# EAGLE design P1R4 (EAGLE 7.2.0)

## Sheet 1 of 3
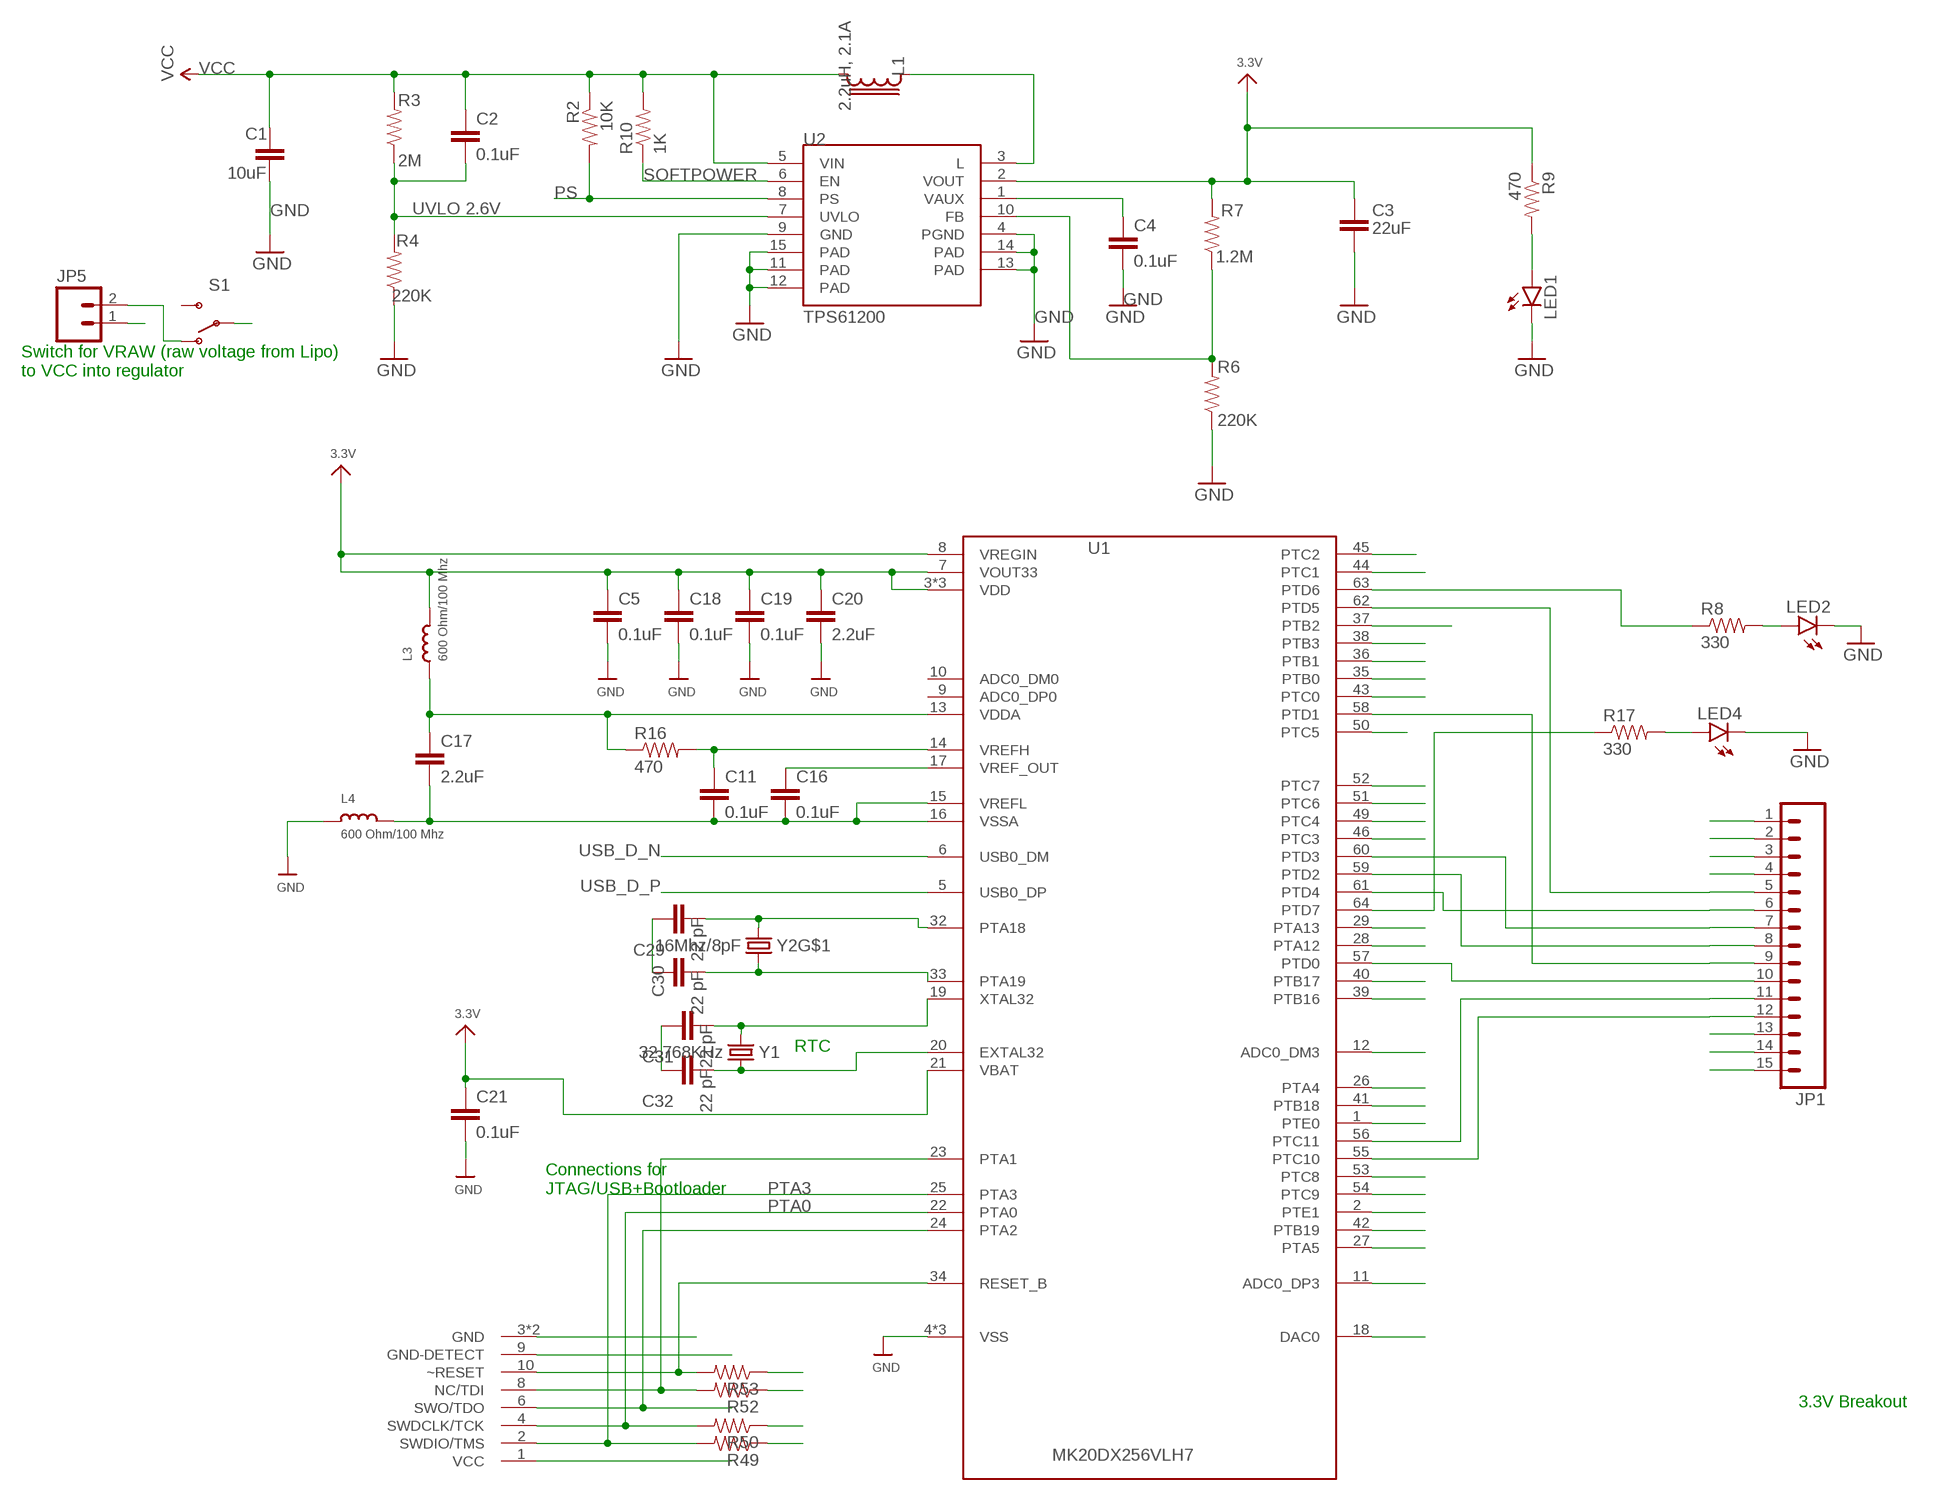
[diagram p0: schematic, sheet 1]

### Parts
C1  10uF  CAPACITOR-10UF  [0603-CAP]
C2  0.1uF  CAPACITOR-0.1UF  [0603-CAP]
C3  22uF  CAPACITOR-22UF  [0603-CAP]
C4  0.1uF  CAPACITOR-0.1UF  [0603-CAP]
C5  0.1uF  CAPACITOR-0.1UF  [0603-CAP]
C11  0.1uF  CAPACITOR-0.1UF  [0603-CAP]
C16  0.1uF  CAPACITOR-0.1UF  [0603-CAP]
C17  2.2uF  CAPACITOR-2.2UF  [0603-CAP]
C18  0.1uF  CAPACITOR-0.1UF  [0603-CAP]
C19  0.1uF  CAPACITOR-0.1UF  [0603-CAP]
C20  2.2uF  CAPACITOR-2.2UF  [0603-CAP]
C21  0.1uF  CAPACITOR-0.1UF  [0603-CAP]
C29  22 pF  CAPACITOR-10UF  [0603-CAP]
C30  22 pF  CAPACITOR-10UF  [0603-CAP]
C31  22 pF  CAPACITOR-10UF  [0603-CAP]
C32  22 pF  CAPACITOR-10UF  [0603-CAP]
JP1  M15  [1X15]
JP5  M02PTH  [1X02]
L1  2.2uH, 2.1A  LPS30152.2UH  [LPS3015]
L3  600 Ohm/100 Mhz  INDUCTOR-BK2125HM601-T  [0805]
L4  600 Ohm/100 Mhz  INDUCTOR-BK2125HM601-T  [0805]
LED1  LED-GREEN  [LED-0603]
LED2  LED-GREEN  [LED-0603]
LED4  LED-GREEN  [LED-0603]
R2  10K  RESISTOR-10K  [0603-RES]
R3  2M  RESISTOR-2M  [0603-RES]
R4  220K  RESISTOR-220K  [0603-RES]
R6  220K  RESISTOR-220K  [0603-RES]
R7  1.2M  RESISTOR-1.2M  [0603-RES]
R8  330  RESISTOR-470  [0603-RES]
R9  470  RESISTOR-470  [0603-RES]
R10  1K  RESISTOR-1K  [0603-RES]
R16  470  RESISTOR-470  [0603-RES]
R17  330  RESISTOR-470  [0603-RES]
R49  RESISTOR0402-RES  [0402-RES]
R50  RESISTOR0402-RES  [0402-RES]
R52  RESISTOR0402-RES  [0402-RES]
R53  RESISTOR0402-RES  [0402-RES]
S1  SWITCH-SPDT-SMD-A  [SWITCH-SPST-SMD-A]
U1  MK20DX256VLH7  [MK20DX256VLH7]
U2  TPS61200  [QFN-10_PAD]
U$7  2X5_0.05"_CORTEX_DEBUGTH_NOKEY_UNSHROUDED  [2X5_0.05"_TH_NS]
Y1  32.768KHz  CRYSTAL/32.768KHZ/SMD-TXC_7A  [CRYSTAL-TXC-7A]
Y2  16Mhz/8pF  CRYSTAL/SMD-5X3-GND16MHZ/8PF  [CRYSTAL-SMD-5X3]

### Nets
3.3V: C3.1 C5.1 C18.1 C19.1 C20.1 C21.1 JP1.13 JP1.14 JP1.15 L3.2 R7.2 R9.1 R49.1 R52.1 R53.1 U1.3(VDD) U1.7(VOUT33) U1.8(VREGIN) U1.21(VBAT) U1.30(VDD) U1.48(VDD) U2.2(VOUT) U$7.1(VCC) ; also sheet 2,3
A12: U1.11(ADC0_DP3)
A13: U1.12(ADC0_DM3)
AD0: U1.45(PTC2) ; also sheet 2
DAC/A14: U1.18(DAC0)
FB: R6.2 R7.1 U2.10(FB)
GND [Top GND Pour]: C1.2 C3.2 C4.2 C5.2 C18.2 C19.2 C20.2 C21.2 C29.1 C30.1 C31.1 C32.1 JP1.1 JP1.2 JP1.3 JP1.4 JP5.1 L4.1 LED1.C LED2.C LED4.C R4.1 R6.1 R50.1 U1.4(VSS) U1.31(VSS) U1.47(VSS) U2.4(PGND) U2.9(GND) U2.11(PAD) U2.12(PAD) U2.13(PAD) U2.14(PAD) U2.15(PAD) U$7.3(GND) U$7.5(GND) U$7.9(GND-DETECT) ; also sheet 2,3
N$1: LED1.A R9.2
N$2: L1.1 U2.3(L)
N$7: LED2.A R8.2
N$10: C31.2 U1.19(XTAL32) Y1.P$2
N$11: C32.2 U1.20(EXTAL32) Y1.P$1
N$27: C29.2 U1.32(PTA18) Y2.3
N$28: C30.2 U1.33(PTA19) Y2.1
N$29: LED4.A R17.2
PS: R2.2 U2.8(PS)
PTA0: R50.2 U1.22(PTA0) U$7.4(SWDCLK/TCK)
PTA1: R52.2 U1.23(PTA1) U$7.8(NC/TDI)
PTA2: U1.24(PTA2) U$7.6(SWO/TDO)
PTA3: R49.2 U1.25(PTA3) U$7.2(SWDIO/TMS)
PTA4: U1.26(PTA4)
PTA5: U1.27(PTA5)
PTA12: U1.28(PTA12)
PTA13: U1.29(PTA13)
PTB0: U1.35(PTB0) ; also sheet 2
PTB1: U1.36(PTB1) ; also sheet 2
PTB16: U1.39(PTB16) ; also sheet 2
PTB17: U1.40(PTB17) ; also sheet 2
PTB18: U1.41(PTB18) ; also sheet 2
PTB19: U1.42(PTB19) ; also sheet 2
PTC0: U1.43(PTC0) ; also sheet 2
PTC1: U1.44(PTC1) ; also sheet 2
PTC3: U1.46(PTC3) ; also sheet 2
PTC4: U1.49(PTC4) ; also sheet 2
PTC5: U1.50(PTC5) ; also sheet 2
PTC6: U1.51(PTC6) ; also sheet 2
PTC7: U1.52(PTC7) ; also sheet 2
PTC8: U1.53(PTC8) ; also sheet 2
PTC9: U1.54(PTC9) ; also sheet 2
PTC10: JP1.12 U1.55(PTC10)
PTC11: JP1.11 U1.56(PTC11)
PTD0: JP1.10 U1.57(PTD0)
PTD1: JP1.9 U1.58(PTD1)
PTD2: JP1.8 U1.59(PTD2)
PTD3: JP1.7 U1.60(PTD3)
PTD4: JP1.6 U1.61(PTD4)
PTD5: JP1.5 U1.62(PTD5)
PTD6: R8.1 U1.63(PTD6)
PTD7: R17.1 U1.64(PTD7)
PTE0: U1.1(PTE0)
PTE1: U1.2(PTE1)
RESET_B: R53.2 U1.34(RESET_B) U$7.10(~RESET)
SCL: U1.37(PTB2) ; also sheet 2,3
SDA: U1.38(PTB3) ; also sheet 2,3
SOFTPOWER: R10.1 U2.6(EN)
USB_D_N [USB]: U1.6(USB0_DM)
USB_D_P [USB]: U1.5(USB0_DP)
UVLO: C2.2 R3.1 R4.2 U2.7(UVLO)
VAUX: C4.1 U2.1(VAUX)
VCC: C1.1 C2.1 L1.2 R2.1 R3.2 R10.2 S1.2(P) U2.5(VIN)
VDDA: C17.1 L3.1 R16.1 U1.13(VDDA)
VRAW: JP5.2 S1.1(O)
VREF_OUT: C16.1 U1.17(VREF_OUT)
VREFH: C11.1 R16.2 U1.14(VREFH)
VREFL: C11.2 C16.2 C17.2 L4.2 U1.15(VREFL) U1.16(VSSA)
Unconnected: S1.3(S) U1.9(ADC0_DP0) U1.10(ADC0_DM0) Y2.2(GND:GND) Y2.4(GND:GND)

### Notes on the sheet
- UVLO 2.6V
- Switch for VRAW (raw voltage from Lipo) 
  to VCC into regulator
- RTC
- Connections for 
  JTAG/USB+Bootloader
- 3.3V Breakout

## Sheet 2 of 3
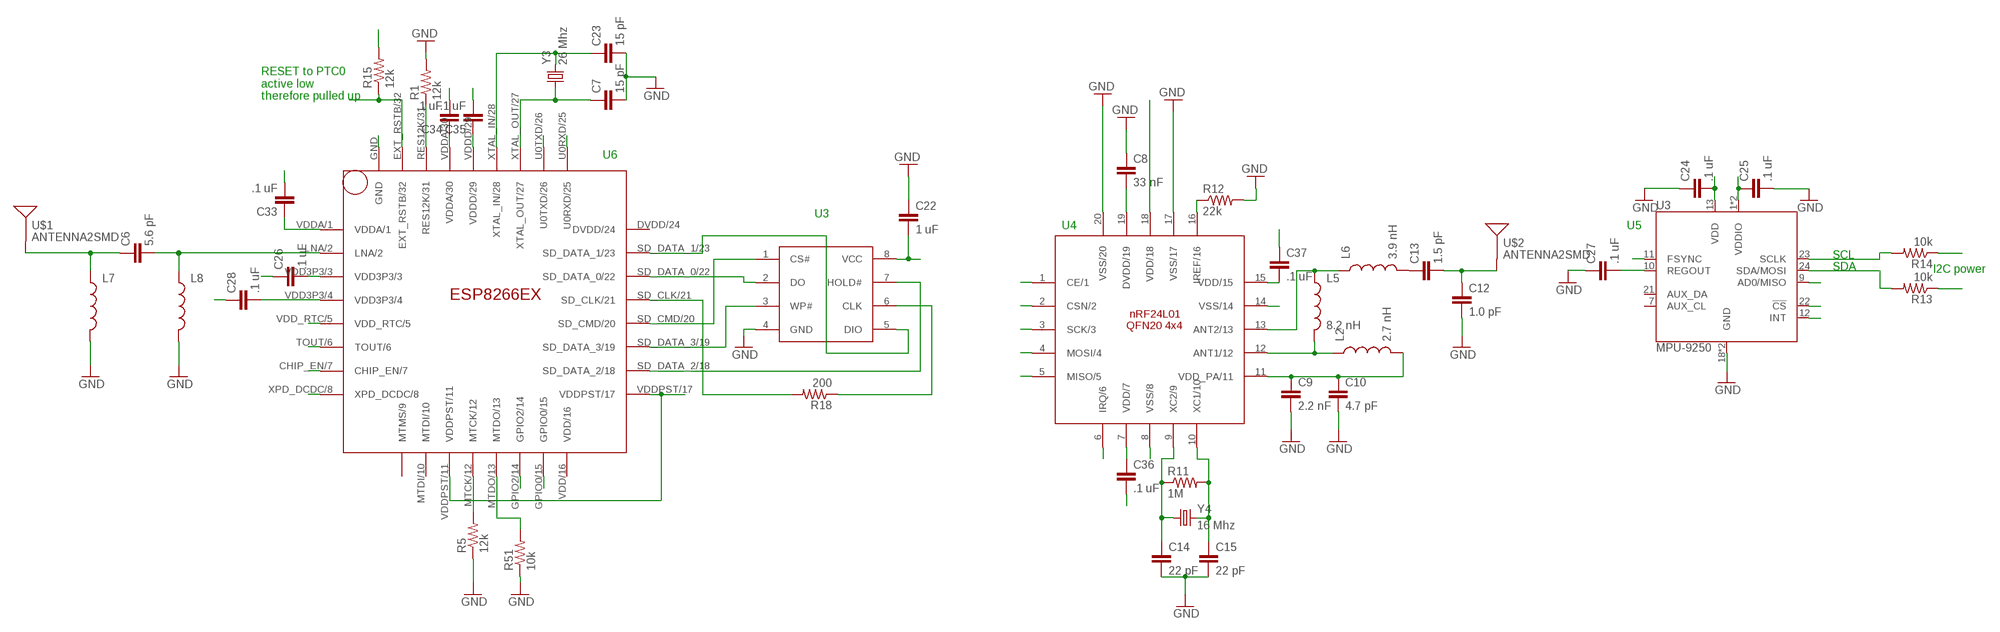
[diagram p1: schematic, sheet 2]

### Parts
C6  5.6 pF  CAP0603-CAP  [0603-CAP]
C7  15 pF  CAP0603-CAP  [0603-CAP]
C8  33 nF  CAP0603-CAP  [0603-CAP]
C9  2.2 nF  CAP0603-CAP  [0603-CAP]
C10  4.7 pF  CAP0603-CAP  [0603-CAP]
C12  1.0 pF  CAP0603-CAP  [0603-CAP]
C13  1.5 pF  CAP0603-CAP  [0603-CAP]
C14  22 pF  CAP0603-CAP  [0603-CAP]
C15  22 pF  CAP0603-CAP  [0603-CAP]
C22  1 uF  CAP0603-CAP  [0603-CAP]
C23  15 pF  CAP0603-CAP  [0603-CAP]
C24  .1 uF  CAP0603-CAP  [0603-CAP]
C25  .1 uF  CAP0603-CAP  [0603-CAP]
C26  .1 uF  CAP0603-CAP  [0603-CAP]
C27  .1 uF  CAP0603-CAP  [0603-CAP]
C28  .1 uF  CAP0603-CAP  [0603-CAP]
C33  .1 uF  CAP0603-CAP  [0603-CAP]
C34  .1 uF  CAP0603-CAP  [0603-CAP]
C35  .1 uF  CAP0603-CAP  [0603-CAP]
C36  .1 uF  CAP0603-CAP  [0603-CAP]
C37  .1 uF  CAP0603-CAP  [0603-CAP]
L2  2.7 nH  INDUCTOR0402  [C0402]
L5  8.2 nH  INDUCTOR0402  [C0402]
L6  3.9 nH  INDUCTOR0402  [C0402]
L7  INDUCTOR30OHM,1.8A  [0603]
L8  INDUCTOR30OHM,1.8A  [0603]
R1  12k  RESISTOR0603-RES  [0603-RES]
R5  12k  RESISTOR0603-RES  [0603-RES]
R11  1M  RESISTOR0603-RES  [0603-RES]
R12  22k  RESISTOR0603-RES  [0603-RES]
R13  10k  RESISTOR0603-RES  [0603-RES]
R14  10k  RESISTOR0603-RES  [0603-RES]
R15  12k  RESISTOR0603-RES  [0603-RES]
R18  200  RESISTOR0603-RES  [0603-RES]
R51  10k  RESISTOR0603-RES  [0603-RES]
U3  MPU-9250  [QFN-24/3MM]
U$1  ANTENNA2SMD  [ANTENNA-CHIP2]
U$2  ANTENNA2SMD  [ANTENNA-CHIP2]
U$3  25Q40  [SOP8]
U$4  NRF24L01  [QFN20(4X4)]
U$6  ESP8266EX  [QFN32]
Y3  26 Mhz  CRYSTAL5X3  [CRYSTAL-SMD-5X3]
Y4  16 Mhz  CRYSTAL5X3  [CRYSTAL-SMD-5X3]

### Nets
3.3V: C22.2 C24.2 C25.1 C26.2 C28.2 C33.1 C34.1 C35.1 C36.1 C37.2 R13.1 R14.1 R15.2 U3.1(VDDIO) U3.8(VDDIO) U3.13(VDD) U3.22(!CS) U$3.8(VCC) U$4.7(VDD/7) U$4.15(VDD/15) U$4.18(VDD/18) U$6.VDD3P3/3 U$6.VDD3P3/4 U$6.VDDA/1 U$6.VDDA/30 U$6.VDDD/29 U$6.VDDPST/11 U$6.VDDPST/17 ; also sheet 1,3
AD0: U3.9(AD0/MISO) ; also sheet 1
GND [Top GND Pour]: C7.2 C8.1 C9.2 C10.2 C12.2 C14.2 C15.2 C22.1 C23.2 C24.1 C25.2 C26.1 C27.1 C28.1 C33.2 C34.2 C35.2 C36.2 C37.1 L7.2 L8.2 R1.2 R5.1 R12.2 R51.1 U3.18(GND) U3.20(GND) U$3.4(GND) U$4.8(VSS/8) U$4.14(VSS/14) U$4.17(VSS/17) U$4.20(VSS/20) U$6.GND ; also sheet 1,3
MTDO: R51.2 U$6.MTDO/13
N$13: C6.2 L8.1 U$6.LNA/2
N$16: C6.1 L7.1 U$1.FEED(SIGNAL)
N$17: C14.1 R11.1 U$4.9(XC2/9) Y4.1
N$18: C15.1 R11.2 U$4.10(XC1/10) Y4.3
N$19: C9.1 C10.1 L2.2 U$4.11(VDD_PA/11)
N$20: L5.1 L6.1 U$4.13(ANT2/13)
N$21: C8.2 U$4.19(DVDD/19)
N$23: L2.1 L5.2 U$4.12(ANT1/12)
N$24: R12.1 U$4.16(IREF/16)
N$25: C13.1 L6.2
N$26: C12.1 C13.2 U$2.FEED(SIGNAL)
N$32: R5.2 U$6.MTCK/12
N$34: C27.2 U3.10(REGOUT)
N$35: R18.1 U$3.6(CLK)
N$38: R1.1 U$6.RES12K/31
PTB0: U3.12(INT) ; also sheet 1
PTB1: U3.11(FSYNC) ; also sheet 1
PTB16: U$6.U0TXD/26 ; also sheet 1
PTB17: U$6.U0RXD/25 ; also sheet 1
PTB18: U$6.GPIO0/15 ; also sheet 1
PTB19: U$6.GPIO2/14 ; also sheet 1
PTC0: R15.1 U$6.EXT_RSTB/32 ; also sheet 1
PTC1: U$6.CHIP_EN/7 ; also sheet 1
PTC3: U$6.XPD_DCDC/8 ; also sheet 1
PTC4: U$4.2(CSN/2) ; also sheet 1
PTC5: U$4.3(SCK/3) ; also sheet 1
PTC6: U$4.4(MOSI/4) ; also sheet 1
PTC7: U$4.5(MISO/5) ; also sheet 1
PTC8: U$4.6(IRQ/6) ; also sheet 1
PTC9: U$4.1(CE/1) ; also sheet 1
RTC: U$6.VDD_RTC/5
SCL: R14.2 U3.23(SCLK) ; also sheet 1,3
SD-CLK: R18.2 U$6.SD_CLK/21
SD-CMD: U$3.1(CS#) U$6.SD_CMD/20
SD-D0: U$3.2(DO) U$6.SD_DATA_0/22
SD-D1: U$3.5(DIO) U$6.SD_DATA_1/23
SD-D2: U$3.7(HOLD#) U$6.SD_DATA_2/18
SD-D3: U$3.3(WP#) U$6.SD_DATA_3/19
SDA: R13.2 U3.24(SDA/MOSI) ; also sheet 1,3
TOUT: U$6.TOUT/6
XTAL_IN: C23.1 U$6.XTAL_IN/28 Y3.3
XTAL_OUT: C7.1 U$6.XTAL_OUT/27 Y3.1
Unconnected: U3.7(AUX_CL) U3.21(AUX_DA) U$6.DVDD/24 U$6.MTDI/10 U$6.MTMS/9 U$6.VDD/16

### Notes on the sheet
- RESET to PTC0
  active low
  therefore pulled up
- U6
- U3
- U4 | U5
- SCL
- I2C power
- SDA

## Sheet 3 of 3
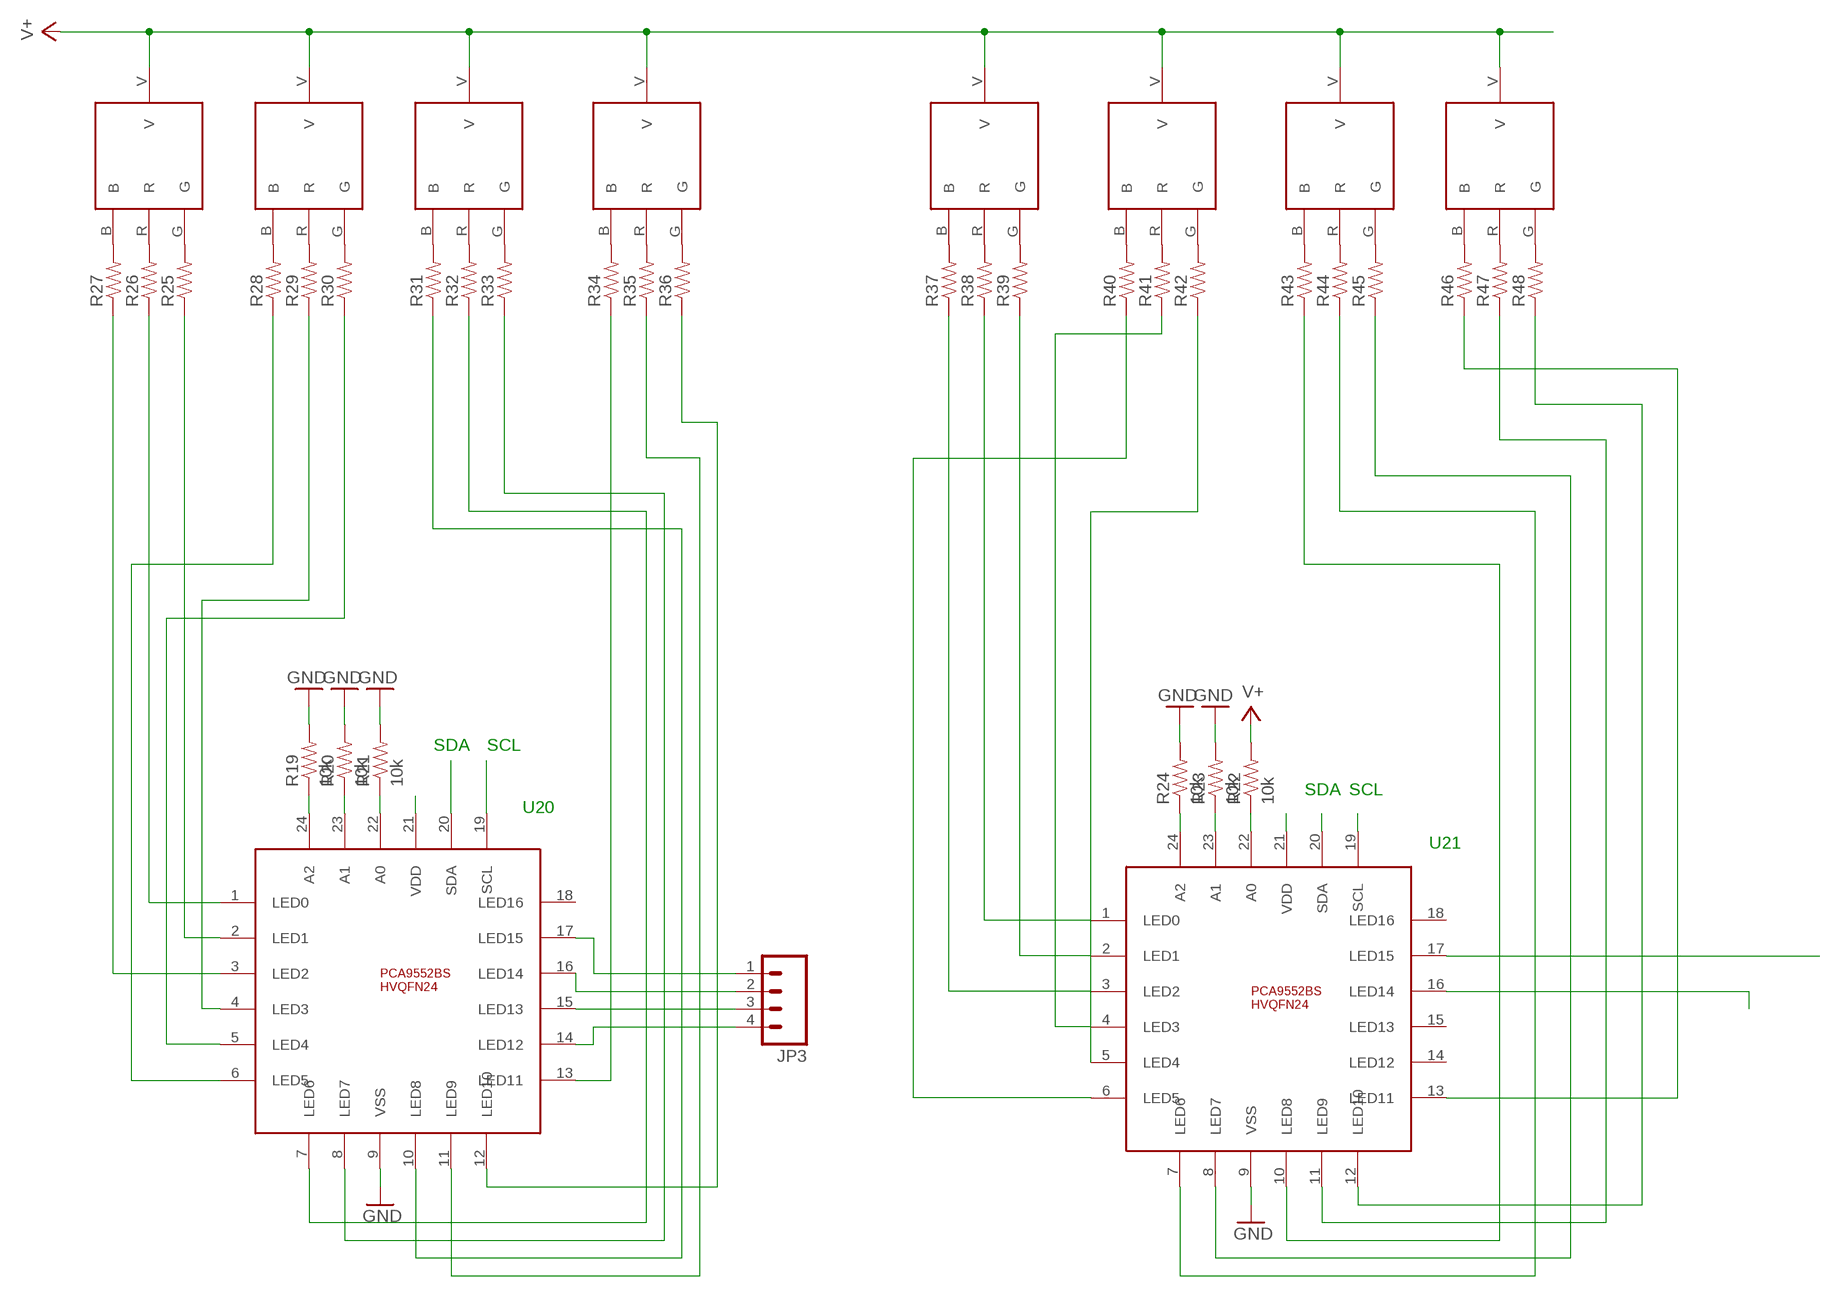
[diagram p2: schematic, sheet 3]

### Parts
JP3  M04PTH  [1X04]
R19  10k  RESISTOR0603-RES  [0603-RES]
R20  10k  RESISTOR0603-RES  [0603-RES]
R21  10k  RESISTOR0603-RES  [0603-RES]
R22  10k  RESISTOR0603-RES  [0603-RES]
R23  10k  RESISTOR0603-RES  [0603-RES]
R24  10k  RESISTOR0603-RES  [0603-RES]
R25  RESISTOR0402-RES  [0402-RES]
R26  RESISTOR0402-RES  [0402-RES]
R27  RESISTOR0402-RES  [0402-RES]
R28  RESISTOR0402-RES  [0402-RES]
R29  RESISTOR0402-RES  [0402-RES]
R30  RESISTOR0402-RES  [0402-RES]
R31  RESISTOR0402-RES  [0402-RES]
R32  RESISTOR0402-RES  [0402-RES]
R33  RESISTOR0402-RES  [0402-RES]
R34  RESISTOR0402-RES  [0402-RES]
R35  RESISTOR0402-RES  [0402-RES]
R36  RESISTOR0402-RES  [0402-RES]
R37  RESISTOR0402-RES  [0402-RES]
R38  RESISTOR0402-RES  [0402-RES]
R39  RESISTOR0402-RES  [0402-RES]
R40  RESISTOR0402-RES  [0402-RES]
R41  RESISTOR0402-RES  [0402-RES]
R42  RESISTOR0402-RES  [0402-RES]
R43  RESISTOR0402-RES  [0402-RES]
R44  RESISTOR0402-RES  [0402-RES]
R45  RESISTOR0402-RES  [0402-RES]
R46  RESISTOR0402-RES  [0402-RES]
R47  RESISTOR0402-RES  [0402-RES]
R48  RESISTOR0402-RES  [0402-RES]
U$8  LTST-C19FD1WT  [LTST-C19FD1WT]
U$11  LTST-C19FD1WT  [LTST-C19FD1WT]
U$13  LTST-C19FD1WT  [LTST-C19FD1WT]
U$14  LTST-C19FD1WT  [LTST-C19FD1WT]
U$15  LTST-C19FD1WT  [LTST-C19FD1WT]
U$16  LTST-C19FD1WT  [LTST-C19FD1WT]
U$17  LTST-C19FD1WT  [LTST-C19FD1WT]
U$18  LTST-C19FD1WT  [LTST-C19FD1WT]
U$20  PCA9552BS  [HVQFN24]
U$21  PCA9552BS  [HVQFN24]

### Nets
3.3V: R22.2 U$8.V U$11.V U$13.V U$14.V U$15.V U$16.V U$17.V U$18.V U$20.21(VDD) U$21.21(VDD) ; supply symbol labelled V+ ; also sheet 1,2
GND [Top GND Pour]: R19.2 R20.2 R21.2 R23.2 R24.2 U$20.9(VSS) U$21.9(VSS) ; also sheet 1,2
N$8: JP3.3 U$20.15(LED13)
N$9: U$21.16(LED14)
N$39: R26.2 U$8.R
N$40: R19.1 U$20.24(A2)
N$41: R27.2 U$8.B
N$42: R25.2 U$8.G
N$45: R28.2 U$11.B
N$46: R29.2 U$11.R
N$47: R30.2 U$11.G
N$48: R27.1 U$20.3(LED2)
N$49: R26.1 U$20.1(LED0)
N$50: R31.2 U$13.B
N$51: R28.1 U$20.6(LED5)
N$60: R32.2 U$13.R
N$61: R33.2 U$13.G
N$62: R34.2 U$14.B
N$63: R35.2 U$14.R
N$73: R25.1 U$20.2(LED1)
N$75: R29.1 U$20.4(LED3)
N$76: R30.1 U$20.5(LED4)
N$78: R32.1 U$20.7(LED6)
N$79: R33.1 U$20.8(LED7)
N$80: R31.1 U$20.10(LED8)
N$81: R36.2 U$14.G
N$82: R35.1 U$20.11(LED9)
N$83: R36.1 U$20.12(LED10)
N$84: R34.1 U$20.13(LED11)
N$85: JP3.4 U$20.14(LED12)
N$86: R37.2 U$15.B
N$87: R20.1 U$20.23(A1)
N$88: R21.1 U$20.22(A0)
N$89: R38.2 U$15.R
N$90: U$21.17(LED15)
N$91: JP3.2 U$20.16(LED14)
N$92: R38.1 U$21.1(LED0)
N$93: R39.1 U$21.2(LED1)
N$94: R37.1 U$21.3(LED2)
N$95: R41.1 U$21.4(LED3)
N$96: R42.1 U$21.5(LED4)
N$97: R40.1 U$21.6(LED5)
N$98: R44.1 U$21.7(LED6)
N$99: R45.1 U$21.8(LED7)
N$100: R39.2 U$15.G
N$101: R43.1 U$21.10(LED8)
N$102: R47.1 U$21.11(LED9)
N$103: R48.1 U$21.12(LED10)
N$104: R46.1 U$21.13(LED11)
N$105: JP3.1 U$20.17(LED15)
N$106: R24.1 U$21.24(A2)
N$107: R23.1 U$21.23(A1)
N$108: R22.1 U$21.22(A0)
N$109: R40.2 U$16.B
N$112: R41.2 U$16.R
N$113: R42.2 U$16.G
N$114: R43.2 U$17.B
N$115: R44.2 U$17.R
N$116: R45.2 U$17.G
N$117: R46.2 U$18.B
N$118: R47.2 U$18.R
N$119: R48.2 U$18.G
SCL: U$20.19(SCL) U$21.19(SCL) ; also sheet 1,2
SDA: U$20.20(SDA) U$21.20(SDA) ; also sheet 1,2
Unconnected: U$20.18(LED16) U$21.14(LED12) U$21.15(LED13) U$21.18(LED16)

### Notes on the sheet
- SDA | SCL
- SDA | SCL
- U20
- U21

## Library data of the parts
C1 = appfruits:CAPACITOR; MF: Murata; MPN: GRM188R60J106ME47D
C2 C4 C5 C11 C16 C18 C19 C21 = appfruits:CAPACITOR; MF: Kemet; MPN: C0603C104J3RACTU
C3 = appfruits:CAPACITOR; MF: Murata; MPN: GRM188R60J226MEA0D
C6-C10 C12-C15 C22-C28 C33-C37 = SparkFun-Capacitors:CAP: Capacitor Standard 0603 ceramic capacitor, and 0.1" leaded capacitor.
C17 C20 = appfruits:CAPACITOR; MF: Kemet; MPN: C0603C225K4PACTU
C29-C32 = appfruits:CAPACITOR; MF: Murata; MPN: GRM188R60J106ME47D; VALUE: 10uF
JP1 = SparkFun-Connectors:M15: Header 15 Standard 15-pin 0.1" header. Use with straight break away headers (SKU : PRT-00116), right angle break away headers (PRT-00553), swiss pins (PRT-00743), machine pins (PRT-00117), and female headers (PRT-00115).
JP3 = SparkFun:M04: Header 4 Standard 4-pin 0.1" header. Use with straight break away headers (SKU : PRT-00116), right angle break away headers (PRT-00553), swiss pins (PRT-00743), machine pins (PRT-00117), and female headers (PRT-00115). Molex polarized connector foot print use with SKU : PRT-08231 with associated crimp pins and housings.
JP5 = SparkFun-Connectors:M02: Standard 2-pin 0.1" header. Use with - straight break away headers ( PRT-00116) - right angle break away headers (PRT-00553) - swiss pins (PRT-00743) - machine pins (PRT-00117) - female headers (PRT-00115) Molex polarized connector foot print use with: PRT-08233 with associated crimp pins and housings. 2.54_SCREWTERM for use with PRT-10571. 3.5mm Screw Terminal footprints for PRT-08084 5mm Screw Terminal footprints for use with PRT-08432
L1 = appfruits:LPS3015: Shielded Power Inductor; MF: Coilcraft; MPN: LPS3015-222MRB
L2 L5 L6 = SparkFun-Passives:INDUCTOR: Inductors
L3 L4 = appfruits:INDUCTOR: Inductors; MF: Taiyo Yuden; MPN: BK2125HM601-T
L7 L8 = SparkFun-Passives:INDUCTOR: Inductors; PROD_ID: RES-07859
LED1 LED2 LED4 = appfruits:LED: LEDs Standard schematic elements and footprints for 5mm, 3mm, 1206, and 0603 sized LEDs. 5mm - Spark Fun Electronics SKU : COM-00529 (and others); MF: Avago; MPN: HSMG-C190
R1 R5 R11-R15 R18 R51 = SparkFun-Resistors:RESISTOR: Resistor
R2 = appfruits:RESISTOR: Resistor; MF: Panasonic; MPN: ERJ-3GEYJ103V
R3 = appfruits:RESISTOR: Resistor; MF: Panasonic; MPN: ERJ-3GEYJ205V
R4 R6 = appfruits:RESISTOR: Resistor; MF: Panasonic; MPN: ERJ-3GEYJ224V
R7 = appfruits:RESISTOR: Resistor; MF: Panasonic; MPN: ERJ-3GEYJ125V
R8 R17 = appfruits:RESISTOR: Resistor; MF: Panasonic; MPN: ERJ-3GEYJ471V; VALUE: 470
R9 R16 = appfruits:RESISTOR: Resistor; MF: Panasonic; MPN: ERJ-3GEYJ471V
R10 = appfruits:RESISTOR: Resistor; MF: Panasonic; MPN: ERJ-3GEYJ102V
R19-R50 R52 R53 = SparkFun:RESISTOR: Resistor
S1 = SparkFun-Electromechanical:SWITCH-SPDT: SPDT Switch Simple slide switch, Spark Fun Electronics SKU : COM-00102 DPDT SMT slide switch, AYZ0202, SWCH-08179
U1 = appfruits:MK20DX256VLH7; MF: Freescale; MPN: MK20DX256VLH7
U2 = appfruits:TPS61200: DC to DC Booster IC-10035; MF: Texas Instruments; MPN: TPS61200DRCR; PROD_ID: IC-10035
U3 = chips:MPU-9250: GYRO/ACCEL/COMPASS/9-AXIS; DIGIKEY: 1428-1019-1-ND
U$1 U$2 = SparkFun-RF:ANTENNA2: Chip antenna Single endded antenna. Common with smaller chip antennas. CHIP4 package is the GPS Chip Antenna SKU: GPS-08418. CHIP5 package is 2.4GHz chip antenna SKU: WRL-00144.
U$3 = wifi:25Q40
U$4 = RF:NRF24L01
U$6 = wifi:ESP8266EX
U$7 = con-cortex:2X5_0.05"_CORTEX_DEBUG
U$8 U$11 U$13-U$18 = led:LTST-C19FD1WT
U$20 U$21 = NXP_By_element14_Batch_1:PCA9552BS
Y1 = appfruits:CRYSTAL/32.768KHZ/SMD-TXC_7A; MF: Epson Timing; MPN: FC-255 32.7680K-A3
Y2 = appfruits:CRYSTAL/SMD-5X3-GND; MF: ECS; MPN: ECS-160-8-30B-CKM
Y3 Y4 = SparkFun-FreqCtrl:CRYSTAL: Various standard crystals. Proven footprints.; PROD_ID: XTAL-08218

## Net classes
1 USB: width 0.254 mm, drill 0.33 mm, clearance 0.159 mm

## Board
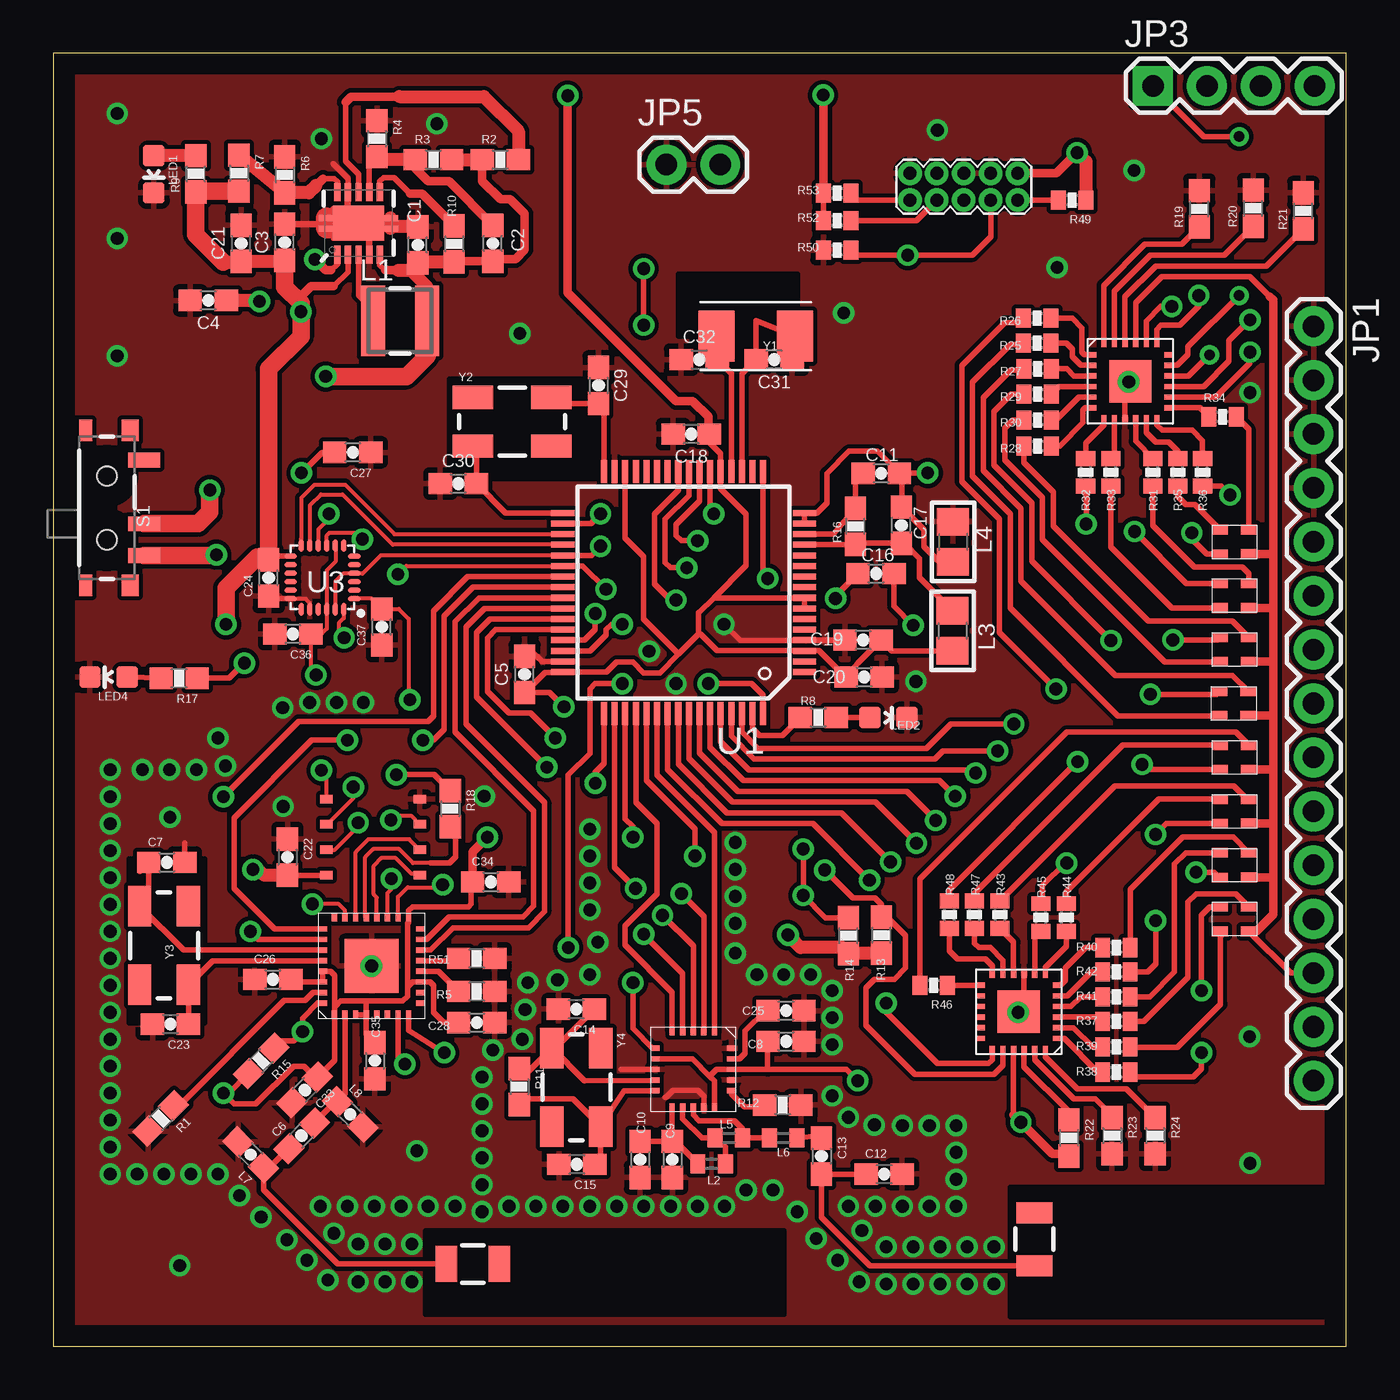
[diagram p3: board, top side]
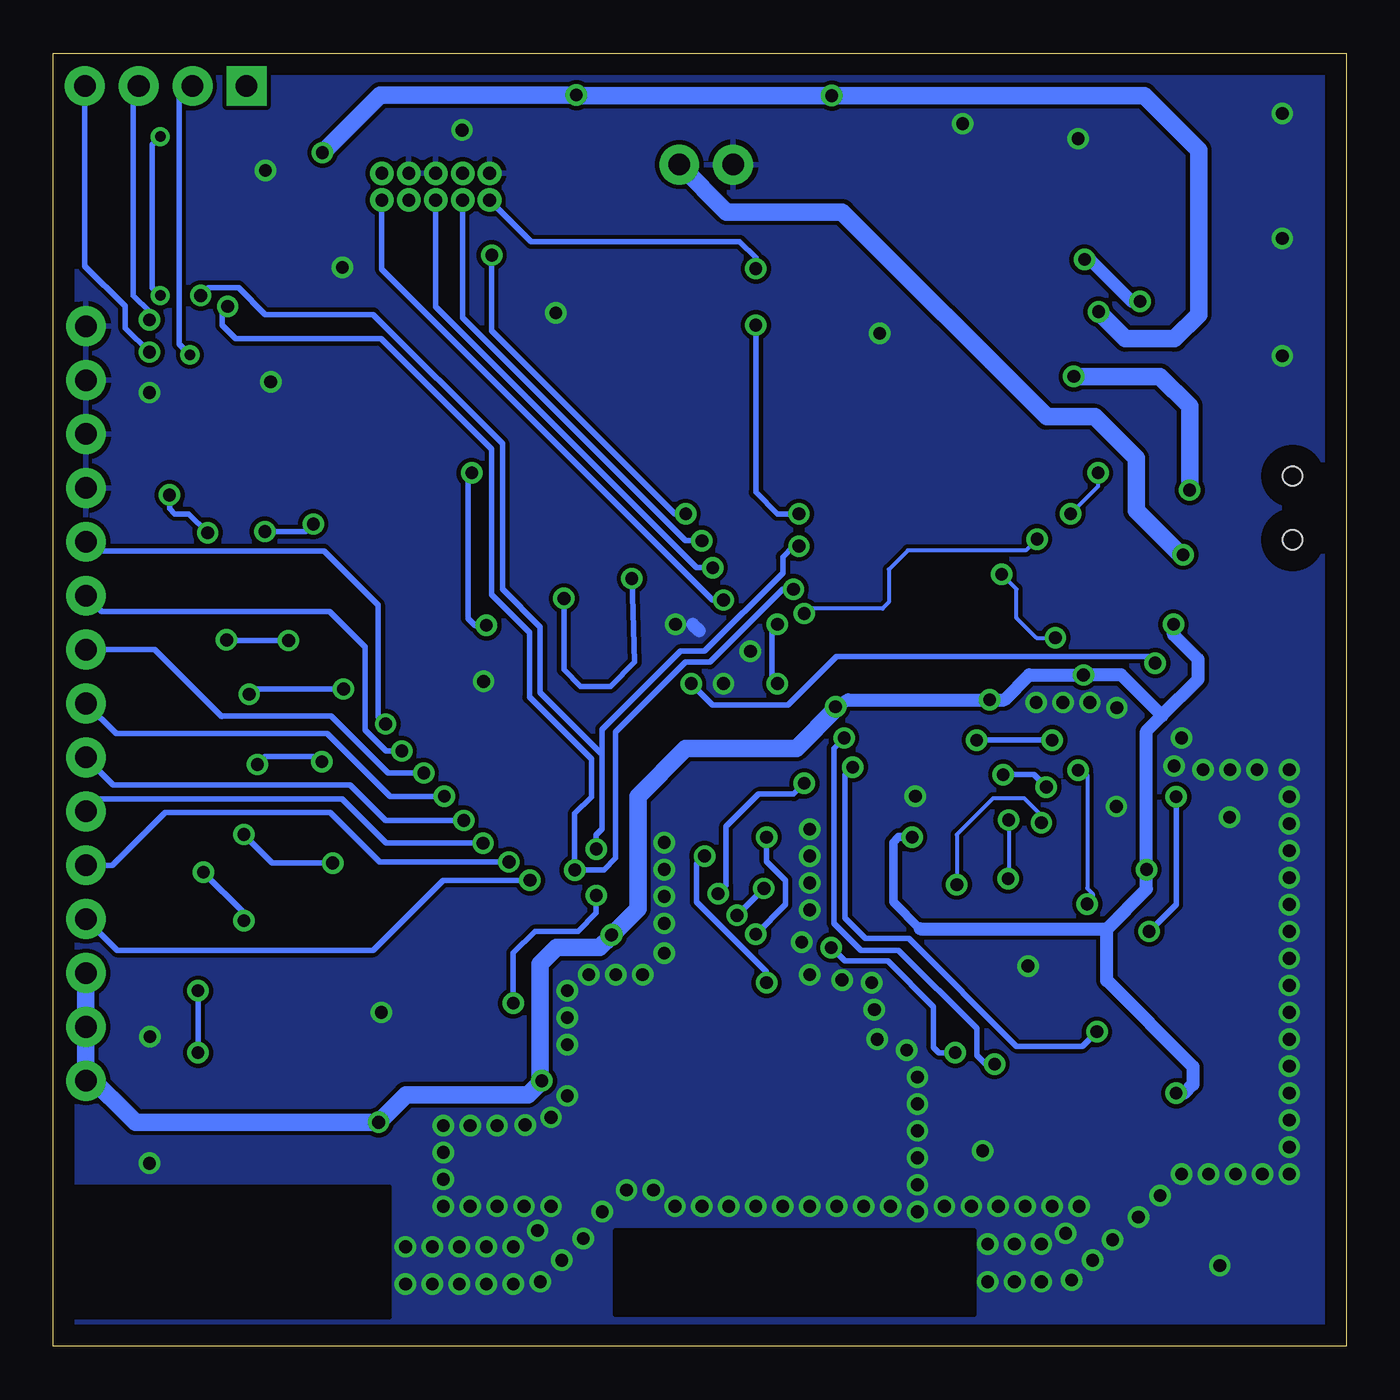
[diagram p4: board, bottom side, seen from below]

Size 60.96 x 60.96 mm. Coordinates in mm from the lower left corner, seen from the top.
Outline: 0,0 60.96,0 60.96,60.96 0,60.96 0,0
Copper layers (1*16): Top 0.035mm / dielectric 1.5mm / Bottom 0.035mm
Design rules "default": minimum track width 10mil, minimum drill 24mil, track to track 8mil, track to pad 8mil, pad to pad 8mil, via to via 8mil, smd to smd 8mil, copper to edge 40mil, drill to drill 8mil, minimum pad ring 10mil, minimum via ring 8mil, stop-mask expansion 4mil, vias tented up to drill 0mil, thermal gap 10mil
tRestrict: area 3.6,15.2 to 7.1,23; area 18.7,40.9 to 25.7,45.6; area 29.5,46.1 to 35.1,50.5; area 45.1,1.4 to 60.9,7.5; area 17.6,1.5 to 34.4,5.5; area 12.2,51.4 to 16.7,54.5
bRestrict: area 45.1,1.4 to 60.9,7.5; area 17.6,1.5 to 34.4,5.5

### Footprints (pad centres in the part's own frame; a part is rotated, then mirrored left to right if it is on the bottom)
0603-CAP = smd 1.1 x 1: 1 -0.85,0; 2 0.85,0
1X15 = drill 1.016 pad 1.88: 1 0,0; 2 2.54,0; 3 5.08,0; 4 7.62,0; 5 10.16,0; 6 12.7,0; 7 15.24,0; 8 17.78,0; 9 20.32,0; 10 22.86,0; 11 25.4,0; 12 27.94,0; 13 30.48,0; 14 33.02,0; 15 35.56,0
1X04 = drill 1.016 pad 1.88 square: 1 0,0 | drill 1.016 pad 1.88: 2 2.54,0; 3 5.08,0; 4 7.62,0
1X02 = drill 1.016 pad 1.88: 1 0,0; 2 2.54,0
LPS3015 = smd 1.14 x 3.3: 1 -1.27,0; 2 1.27,0
C0402 = smd 0.7 x 0.9: 1 -0.65,0; 2 0.65,0
0805 = smd 1.3 x 1.5: 1 -0.95,0; 2 0.95,0
0603 = smd 1.1 x 1: 1 -0.85,0; 2 0.85,0
LED-0603 = smd 1 x 1: A 0,-0.877; C 0,0.877
0603-RES = smd 1.1 x 1: 1 -0.85,0; 2 0.85,0
0402-RES = smd 0.7 x 0.9: 1 -0.65,0; 2 0.65,0
SWITCH-SPST-SMD-A = smd 0.7 x 1.5: 1 -2.25,-1.75; 2 -0.75,-1.75; 3 2.25,-1.75 | smd 1 x 0.6: GND1 -3.65,1; GND3 3.65,1 | smd 1 x 0.8: GND2 -3.65,-1.1; GND4 3.65,-1.1 | hole 0.9: -1.5,0; 1.5,0
MK20DX256VLH7 = smd 1.1 x 0.285: 1 -5.7,3.75; 2 -5.7,3.25; 3 -5.7,2.75; 4 -5.7,2.25; 5 -5.7,1.75; 6 -5.7,1.25; 7 -5.7,0.75; 8 -5.7,0.25; 9 -5.7,-0.25; 10 -5.7,-0.75; 11 -5.7,-1.25; 12 -5.7,-1.75; 13 -5.7,-2.25; 14 -5.7,-2.75; 15 -5.7,-3.25; 16 -5.7,-3.75; 33 5.7,-3.75; 34 5.7,-3.25; 35 5.7,-2.75; 36 5.7,-2.25; 37 5.7,-1.75; 38 5.7,-1.25; 39 5.7,-0.75; 40 5.7,-0.25; 41 5.7,0.25; 42 5.7,0.75; 43 5.7,1.25; 44 5.7,1.75; 45 5.7,2.25; 46 5.7,2.75; 47 5.7,3.25; 48 5.7,3.75 | smd 0.285 x 1.1: 17 -3.75,-5.7; 18 -3.25,-5.7; 19 -2.75,-5.7; 20 -2.25,-5.7; 21 -1.75,-5.7; 22 -1.25,-5.7; 23 -0.75,-5.7; 24 -0.25,-5.7; 25 0.25,-5.7; 26 0.75,-5.7; 27 1.25,-5.7; 28 1.75,-5.7; 29 2.25,-5.7; 30 2.75,-5.7; 31 3.25,-5.7; 32 3.75,-5.7; 49 3.75,5.7; 50 3.25,5.7; 51 2.75,5.7; 52 2.25,5.7; 53 1.75,5.7; 54 1.25,5.7; 55 0.75,5.7; 56 0.25,5.7; 57 -0.25,5.7; 58 -0.75,5.7; 59 -1.25,5.7; 60 -1.75,5.7; 61 -2.25,5.7; 62 -2.75,5.7; 63 -3.25,5.7; 64 -3.75,5.7
QFN-10_PAD = smd 0.297 x 0.85: 1 -1,-1.475; 2 -0.5,-1.475; 3 0,-1.475; 4 0.5,-1.475; 5 1,-1.475; 6 1,1.475; 7 0.5,1.475; 8 0,1.475; 9 -0.5,1.475; 10 -1,1.475 | smd 0.7 x 0.28: 11 -1.5,0.25; 12 -1.5,-0.25; 13 1.5,0.25; 14 1.5,-0.25 | smd 2.4 x 1.65: 15 0,0
QFN-24/3MM = smd 0.6 x 0.23: 1 -1.5,1; 2 -1.5,0.6; 3 -1.5,0.2; 4 -1.5,-0.2; 5 -1.5,-0.6; 6 -1.5,-1; 13 1.5,-1; 14 1.5,-0.6; 15 1.5,-0.2; 16 1.5,0.2; 17 1.5,0.6; 18 1.5,1 | smd 0.23 x 0.6: 7 -1,-1.5; 8 -0.6,-1.5; 9 -0.2,-1.5; 10 0.2,-1.5; 11 0.6,-1.5; 12 1,-1.5; 19 1,1.5; 20 0.6,1.5; 21 0.2,1.5; 22 -0.2,1.5; 23 -0.6,1.5; 24 -1,1.5
ANTENNA-CHIP2 = smd 1.7 x 1: FEED 0,1.25; P$2 0,-1.25
SOP8 = smd 0.6 x 0.4: 1 -2.2,1.8; 2 -2.2,0.6; 3 -2.2,-0.6; 4 -2.2,-1.8; 5 2.2,-1.8; 6 2.2,-0.6; 7 2.2,0.6; 8 2.2,1.8
QFN20(4X4) = smd 0.4 x 0.25: 1 -1.8,1; 2 -1.8,0.5; 3 -1.8,0; 4 -1.8,-0.5; 5 -1.8,-1; 11 1.8,-1; 12 1.8,-0.5; 13 1.8,0; 14 1.8,0.5; 15 1.8,1 | smd 0.25 x 0.4: 6 -1,-1.8; 7 -0.5,-1.8; 8 0,-1.8; 9 0.5,-1.8; 10 1,-1.8; 16 1,1.8; 17 0.5,1.8; 18 0,1.8; 19 -0.5,1.8; 20 -1,1.8
QFN32 = smd 0.4 x 0.25: CHIP_EN/7 -2.3,-1.25; DVDD/24 2.3,1.75; LNA/2 -2.3,1.25; SD_CLK/21 2.3,0.25; SD_CMD/20 2.3,-0.25; SD_DATA_0/22 2.3,0.75; SD_DATA_1/23 2.3,1.25; SD_DATA_2/18 2.3,-1.25; SD_DATA_3/19 2.3,-0.75; TOUT/6 -2.3,-0.75; VDD3P3/3 -2.3,0.75; VDD3P3/4 -2.3,0.25; VDD_RTC/5 -2.3,-0.25; VDDA/1 -2.3,1.75; VDDPST/17 2.3,-1.75; XPD_DCDC/8 -2.3,-1.75 | smd 0.25 x 0.4: EXT_RSTB/32 -1.75,2.3; GPIO0/15 1.25,-2.3; GPIO2/14 0.75,-2.3; MTCK/12 -0.25,-2.3; MTDI/10 -1.25,-2.3; MTDO/13 0.25,-2.3; MTMS/9 -1.75,-2.3; RES12K/31 -1.25,2.3; U0RXD/25 1.75,2.3; U0TXD/26 1.25,2.3; VDD/16 1.75,-2.3; VDDA/30 -0.75,2.3; VDDD/29 -0.25,2.3; VDDPST/11 -0.75,-2.3; XTAL_IN/28 0.25,2.3; XTAL_OUT/27 0.75,2.3 | smd 2.54 x 2.54: GND 0,0
2X5_0.05"_TH_NS = drill 0.6 pad 0.95: 1 -2.54,-0.635; 2 -2.54,0.635; 3 -1.27,-0.635; 4 -1.27,0.635; 5 0,-0.635; 6 0,0.635; 7 1.27,-0.635; 8 1.27,0.635; 9 2.54,-0.635; 10 2.54,0.635
LTST-C19FD1WT = smd 0.75 x 0.45: B 0.68,0.58; G -0.68,-0.58; P$5 0.68,-0.58; R -0.68,0.58; V 0.68,-0.57
HVQFN24 = smd 0.4 x 0.25: 1 -1.8,1.25; 2 -1.8,0.75; 3 -1.8,0.25; 4 -1.8,-0.25; 5 -1.8,-0.75; 6 -1.8,-1.25; 13 1.8,-1.25; 14 1.8,-0.75; 15 1.8,-0.25; 16 1.8,0.25; 17 1.8,0.75; 18 1.8,1.25 | smd 0.25 x 0.4: 7 -1.25,-1.8; 8 -0.75,-1.8; 9 -0.25,-1.8; 10 0.25,-1.8; 11 0.75,-1.8; 12 1.25,-1.8; 19 1.25,1.8; 20 0.75,1.8; 21 0.25,1.8; 22 -0.25,1.8; 23 -0.75,1.8; 24 -1.25,1.8 | smd 2 x 2: P$1 0,0
CRYSTAL-TXC-7A = smd 1.7 x 2.4: P$1 1.85,0; P$2 -1.85,0
CRYSTAL-SMD-5X3 = smd 1.9 x 1.1: 1 -1.85,-1.15; 2 1.85,-1.15; 3 1.85,1.15; 4 -1.85,1.15

### Placement (x,y rotation side)
C1  17.2,51.92 90 top
C2  20.73,51.99 90 top
C3  10.92,52.04 90 top
C4  7.32,49.3 180 top
C5  22.23,31.67 90 top
C6  11.71,9.93 45 top
C7  5.36,22.81 0 top
C8  34.54,15.82 180 top
C9  29.18,8.81 270 top
C10  27.66,8.81 270 top
C11  39.04,41.15 0 top
C12  39.17,8.13 0 top
C13  36.22,8.97 270 top
C14  24.66,15.9 180 top
C15  24.69,8.59 180 top
C16  38.79,36.42 0 top
C17  39.98,38.71 90 top
C18  30.07,43 180 top
C19  38.18,33.3 180 top
C20  38.23,31.55 0 top
C21  8.86,51.99 90 top
C22  11.05,23.06 270 top
C23  5.54,15.19 180 top
C24  10.16,36.22 90 top
C25  34.54,14.38 0 top
C26  10.36,17.3 0 top
C27  14.12,42.14 180 top
C28  19.96,15.27 180 top
C29  25.7,45.29 270 top
C30  19.1,40.67 0 top
C31  33.99,46.51 180 top
C32  30.45,46.51 0 top
C33  11.86,12.09 225 top
C34  20.62,21.89 0 top
C35  15.16,13.46 270 top
C36  11.3,33.58 180 top
C37  15.49,33.91 90 top
JP1  59.41,48.08 270 top
JP3  51.84,59.41 0 top
JP5  28.91,55.7 0 top
L1  16.36,48.34 0 top
L2  31.04,8.61 180 top
L3  42.39,33.73 270 top
L4  42.42,37.92 270 top
L5  31.85,9.83 180 top
L6  34.42,9.83 0 top
L7  9.32,9.04 135 top
L8  14,10.95 315 top
LED1  4.75,55.24 180 top
LED2  39.37,29.64 270 top
LED4  2.62,31.55 90 top
R1  5.08,10.74 225 top
R2  21.08,55.93 0 top
R3  17.93,55.93 0 top
R4  15.27,56.92 270 top
R5  19.96,16.74 180 top
R6  10.92,55.22 270 top
R7  8.76,55.3 270 top
R8  36.07,29.64 0 top
R9  6.73,55.27 90 top
R10  18.9,51.97 270 top
R11  21.97,12.24 270 top
R12  34.39,11.38 0 top
R13  39.04,19.38 90 top
R14  37.49,19.35 90 top
R15  9.8,13.46 225 top
R16  37.82,38.66 90 top
R17  5.94,31.5 180 top
R18  18.72,25.35 270 top
R19  54.03,53.62 90 top
R20  56.57,53.64 90 top
R21  58.93,53.52 90 top
R22  47.88,9.83 270 top
R23  49.91,9.93 270 top
R24  51.94,9.93 270 top
R25  46.38,47.29 180 top
R26  46.38,48.46 180 top
R27  46.41,46.08 180 top
R28  46.41,42.44 180 top
R29  46.41,44.88 180 top
R30  46.41,43.66 180 top
R31  51.84,41.2 270 top
R32  48.67,41.2 270 top
R33  49.86,41.2 270 top
R34  55.12,43.81 0 top
R35  53.01,41.2 270 top
R36  54.18,41.2 270 top
R37  50.11,15.32 0 top
R38  50.11,12.93 0 top
R39  50.11,14.12 0 top
R40  50.11,18.8 0 top
R41  50.11,16.48 0 top
R42  50.11,17.65 0 top
R43  44.63,20.35 90 top
R44  47.75,20.22 90 top
R45  46.56,20.22 90 top
R46  41.5,17.02 180 top
R47  43.43,20.35 90 top
R48  42.24,20.35 90 top
R49  48.03,54.03 180 top
R50  36.96,51.66 0 top
R51  19.96,18.29 180 top
R52  36.96,53.06 0 top
R53  36.96,54.36 0 top
S1  2.54,39.52 90 top
U1  29.72,35.53 180 top
U2  14.4,52.93 0 top
U3  12.7,36.25 180 top
U$1  19.79,3.89 90 top
U$2  46.25,5.05 180 top
U$3  15.09,24 180 top
U$4  30.18,13.06 270 top
U$6  15.01,17.93 90 top
U$7  42.93,54.66 180 top
U$8  55.65,30.3 0 top
U$11  55.68,32.84 0 top
U$13  55.68,35.38 0 top
U$14  55.68,37.92 0 top
U$15  55.68,20.14 0 top
U$16  55.68,22.68 0 top
U$17  55.68,25.22 0 top
U$18  55.68,27.76 0 top
U$20  50.77,45.49 0 top
U$21  45.52,15.77 180 top
Y1  33.12,47.62 180 top
Y2  21.64,43.59 0 top
Y3  5.23,18.9 270 top
Y4  24.66,12.22 270 top

### Tracks (layer width: path | path; a pad name or v marks a point on that pad's centre or on a via)
3.3V  (via drill 0.6)  (1 unrouted)
  Top 0.178: U3.8 13.31,37.74 13.31,36.98 12.9,36.57 U3.22 | U3.1 15.03,35.25 15.03,35.22 C37.2 16.3,34.76 16.76,34.29 16.76,30.53 v16.82,30.48 | U3.22 12.9,34.83 | U3.22 12.9,33.83 12.47,33.4 12.29,33.58 C36.1 | 12,33.4 C36.1 | 12.9,35.08 U3.22 | v12.39,31.65 12.15,31.89 C36.1
  Top 0.254: U1.21 31.46,41.25 | U1.3 | U1.3 36.09,32.79 37.45,31.43 C20.1 37.95,32.22 C19.1 39.54,32.78 L3.2 | U1.7 U1.8 31.14,35.28 | U1.3 31.29,32.79 30.5,33.58 30.43,33.58 | 31.14,35.28 30.45,34.59 30.43,34.59 30.43,33.58 | C24.2 10.34,37.25 U3.13 | U2.2 13.9,50.63 13.23,49.96 | U$6.VDDA/1 13.26,17.5 13.08,17.68 U$6.VDDD/29 U$6.VDDA/30 11.33,17.18 C26.2 | U$6.VDDA/1 13.26,15.98 13.56,16.28 14.76,16.28 | U$6.VDD3P3/3 U$6.VDD3P3/4 | 16.71,16.94 16.71,16.51 16.48,16.28 14.76,16.28 | 16.71,16.94 16.95,17.18 U$6.VDDPST/11 17.77,17.18 17.93,17.02 17.93,15.75 18.41,15.27 C28.2 | 16.71,16.94 16.71,19.94 16.76,19.99 U$6.VDDPST/17 16.76,20.55 16.94,20.73 19.58,20.73 19.71,20.85 19.71,22.1 | U$4.15 31.18,12.51 30.95,12.74 | 30.95,12.74 30.13,13.56 U$4.7 | JP1.13 58.33,17.6 U$15.V | U$6.VDD3P3/4 14.76,14.71 C35.1 | U$6.VDDA/1 13.26,13.49 C33.1 12.35,12.69 11.84,13.21 11.33,13.21 9.55,11.43 8.53,11.43 v8.03,11.94 8.28,11.94 R15.2 | 56.63,22.11 U$16.V | U1.30 26.97,38.11 27.84,37.24 27.84,34.29 29.49,32.64 | R52.1 R53.1 | 57.35,49.48 56.41,50.42 52.25,50.42 51.02,49.2 U$20.21 | U1.21 31.47,40.44 32.66,39.24 32.66,36.8 31.14,35.28 | U$3.8 C22.2 | 33.68,13.06 33.68,14.36 C25.1 | v37.92,12.52 37.39,13.06 33.68,13.06 | 33.68,13.06 U$4.18 31.27,13.06 30.95,12.74 | v24.08,30.15 23.41,30.82 C5.1 22.57,31.15 23.19,31.77 U1.48 26.09,31.79 26.57,32.26 27.33,32.26 27.84,31.75 28.6,31.75 29.49,32.64 | C18.1 30.92,42.63 31.47,42.09 U1.21 | 29.49,32.64 30.43,33.58 | U$6.VDD3P3/4 14.76,16.28 | U$21.21 45.27,10.93 45.26,10.92
  Top 0.406: C22.2 | 13.23,49.96 12.15,49.96 11.68,49.49 v11.68,48.77 | C34.1 19.77,23.3 v20.47,24 | 45.27,10.92 v45.62,10.57 47.1,9.08 47.78,9.08 R22.2 | U$7.1 47.3,55.3 v48.26,56.26 | R53.1 36.31,58.31 v36.3,58.98 | v24.26,58.95 24.26,49.66 29.36,44.55 30.15,44.55 30.89,43.81 30.89,42.93 | 57.35,49.48 57.51,49.33 57.51,37.31 | 57.51,37.31 57.51,34.85 | 57.51,34.85 57.51,32.21 | 57.51,32.21 57.51,29.77 | 57.51,29.77 57.51,27.15 | 57.51,27.15 57.51,24.69 | 57.51,24.69 57.51,22.02 | 57.51,22.02 57.51,20.37 56.71,19.57 U$15.V | 56.63,22.11 57.41,22.11 57.51,22.02 | U$17.V 57.47,24.65 57.51,24.69 | U$18.V 57.47,27.19 57.51,27.15 | U$8.V 57.47,29.73 57.51,29.77 | U$11.V 57.44,32.27 57.51,32.21 | U$13.V 57.47,34.81 57.51,34.85 | U$14.V 57.47,37.35 57.51,37.31
  Top 0.61: R7.2 8.45,54.45 | 8.03,51.1 8.83,51.1 C21.1 10.87,51.14 C3.1 | C22.2 9.95,22.2 9.68,22.48 v9.42,22.48 | R13.1 37.52,18.53 | 37.52,18.53 R14.1 | v48.26,56.26 48.68,55.84 R49.1 | v34.65,19.38 34.98,19.05 | 37.52,18.53 37.25,18.8 35.23,18.8 v34.62,19.41
  Top 0.813: 8.03,51.1 6.73,52.4 R9.1 6.76,54.45 R7.2 | C3.1 10.92,49.94 11.68,49.17 v11.68,48.77 11.68,47.6 10.16,46.08 C24.2 10.02,37.21 9.63,37.21 8.15,35.74 v8.15,34.04
  Bottom 0.254: 34.7,19.3 34.7,19.33 v34.65,19.38
  Bottom 0.406: v20.47,24 21.11,24 21.36,23.75 21.36,20.95 20.09,19.68
  Bottom 0.61: v24.08,30.15 23.5,30.48 v16.82,30.48 16.13,30.48 14.96,31.65 v12.39,31.65 10.62,31.65 8.7,29.73 | v34.62,19.41 v34.65,19.38 | 20.09,19.68 11.3,19.68 | 9.42,22.23 v9.42,22.48 | v8.03,11.94 7.64,11.94 7.24,12.34 7.24,13.18 11.3,17.25 11.3,19.68 | 11.3,19.68 9.42,21.57 v9.42,22.48 | v9.42,22.48 9.42,29.01 8.7,29.73 | 8.7,29.73 6.99,31.45 6.99,32.38 8.15,33.55 v8.15,34.04
  Bottom 0.813: JP1.13 JP1.14 | JP1.14 59.16,14.81 | JP1.15 JP1.14 | JP1.14 59.41,12.9 57.07,10.57 v45.62,10.57 44.32,11.86 38.58,11.86 v37.92,12.52 38,12.6 38,18.03 37.24,18.8 35.2,18.8 34.7,19.3 | v24.08,30.15 24.03,30.1 25.93,28.19 31.14,28.19 33.4,25.93 33.4,20.62 v34.62,19.41 | v11.68,48.77 10.41,47.5 8.1,47.5 6.96,48.64 6.96,56.39 9.53,58.95 v24.26,58.95 36.17,58.95 v36.3,58.98 45.54,58.98 v48.26,56.26
AD0  (via drill 0.6)
  Top 0.178: 14.33,38.3 v14.58,38.05 14.28,38.35 13.03,38.35 12.9,38.22 U3.9
  Top 0.254: U1.45 25.05,33.28 25.55,33.78 v25.55,34.54
  Bottom 0.178: v14.58,38.05 15.11,37.52 20.68,37.52 21.57,36.63 21.57,35.08 21.87,34.77 25.32,34.77 v25.55,34.54
FB
  Top 0.254: U2.10 13.4,54.9 13.26,55.04 12.72,55.04
  Top 0.406: 12.72,55.04 12.39,54.71
  Top 0.61: R7.1 R6.2 12.05,54.37 12.39,54.71
GND  (via drill 0.6)
  Top 0.178: U3.20 12.1,35.04 11.91,35.23 11.22,35.23 U3.18 | 12.9,52.73 U2.12 | C5.2 22.75,32.52 23.01,32.26
  Top 0.254: U1.47 23.06,32.28 22.49,32.85 C5.2 | U1.4 35.43,33.3 C19.2 37.3,33.27 32.41,33.27 v31.62,34.04 | C24.1 10.29,35.25 U3.18 | U2.9 13.92,54.43 13.92,55.04 13.21,55.75 | 11.23,24.09 C22.1 10.97,23.99 | U$4.8 26.77,13.06 | U$4.14 30.68,11.79 30.4,12.06 29.21,12.06 28.88,11.73 28.85,11.73 | U$6.GND 15.01,18.36 14.78,18.59 | U$21.9 45.77,16.02 v45.49,15.75 | U$20.9 50.52,45.29 v50.7,45.47 | 6.21,23.74 C7.2 | C34.2 21.57,21.89
  Top 0.305: U2.9 13.89,53.49 14.4,53.49 U2.15 14.9,52.43 U2.4 | C3.2 12.69,52.9 U2.12
  Top 0.406: U2.13 15.22,52.5 14.63,52.5 14.4,52.73 U2.15 | R4.1 15.1,57.71 | 10.88,56.09 R6.1
  Top 0.61: C1.2 15.9,52.77 | 15.9,52.77 U2.13 | 15.9,52.77 U2.14
  Top 1.016: 14.4,52.73 12.9,52.73 U2.11
  Bottom 0.254: 15.21,17.73 U$6.GND
  Bottom 0.61: 30.81,34.04 30.5,33.73
  other vias: 40.67,31.34 38.71,10.44 15.01,17.93 56.41,44.96 10.85,25.45 5.51,24.94 20.32,25.93 18.08,57.63 12.65,56.92 14.63,30.35 13.36,30.35 12.09,30.35 10.82,30.1 8.13,27.36 6.76,27.18 5.49,27.18 4.22,27.18 2.69,27.18 2.69,25.91 2.69,24.64 2.69,23.37 2.69,22.1 2.69,20.83 2.69,19.56 2.69,18.29 2.69,17.02 2.69,15.75 2.69,14.48 2.69,13.21 2.69,11.94 2.69,10.67 2.69,9.4 2.69,8.13 3.96,8.13 5.23,8.13 6.5,8.13 7.77,8.13 8.79,7.11 9.8,6.1 12.6,6.6 13.87,6.6 15.14,6.6 16.41,6.6 17.68,6.6 18.95,6.6 20.22,6.35 20.22,7.62 20.22,8.89 20.22,10.16 20.22,11.43 20.22,12.7 22.12,14.48 22.25,15.88 25.3,17.53 25.3,20.57 25.3,21.84 25.3,23.11 25.3,24.38 21.49,6.6 22.76,6.6 24.03,6.6 25.3,6.6 26.57,6.6 27.84,6.6 29.11,6.6 30.38,6.6 31.65,6.6 32.66,7.37 33.93,7.37 35.08,6.35 37.49,6.6 38.76,6.6 40.03,6.6 41.3,6.6 42.57,6.6 42.57,7.87 42.57,9.14 42.57,10.41 40.03,10.41 41.3,10.41 37.49,10.79 36.73,11.81 36.73,14.22 36.73,15.49 36.73,16.76 35.71,17.53 34.44,17.53 33.17,17.53 32.16,18.54 32.16,19.94 32.16,21.21 32.16,22.48 32.16,23.75 28.09,32.77 29.36,31.24 20.73,13.97 22.38,17.14 23.77,17.27 25.68,19.05 11.02,5.03 11.96,4.06 12.95,3.12 14.38,3.05 15.65,3.05 16.92,3.05 16.92,4.83 15.65,4.83 14.38,4.83 13.23,5.33 44.35,2.95 44.35,4.7 43.08,2.95 43.08,4.7 41.81,4.7 41.81,2.95 40.54,2.95 40.54,4.7 39.27,4.7 39.27,2.95 38.13,5.46 35.97,5.08 36.98,4.06 38,3.05 56.39,14.61 56.41,8.64 17.14,9.22 5.97,3.81 7.77,28.68 3.02,46.69 3.02,52.22 3.02,58.12 22,47.75 37.26,48.72 41.68,57.33 50.95,55.42 47.32,50.85
  pour Top: -2.31,62.26 64.64,63.27 62.76,-0.53 -1.91,-2.26
  pour Bottom: -1.8,62.61 65.25,61.8 63.02,-1.47 -1.22,-1.4
MTDO
  Top 0.254: U$6.MTDO/13 19.01,18.18 R51.2
N$1
  Top 0.61: R9.2 LED1.A
N$2
  Top 0.254: U2.3 14.4,49.55 15.09,48.87 L1.1
N$7
  Top 0.254: R8.2 LED2.A
N$8  (via drill 0.6)
  Top 0.254: U$20.15 54.23,45.24 55.42,46.43 55.42,47.4 v56.41,48.39
  Bottom 0.254: v56.41,48.39 56.41,48.77 57.17,49.53 57.17,59.16 JP3.3
N$10
  Top 0.254: Y1.P$2 33.13,48.35 C31.2 32.47,45.84 U1.19
N$11
  Top 0.254: Y1.P$1 31.3,48.38 C32.2 31.97,45.84 U1.20
N$13
  Top 0.254: C6.2 13.33,11.55 L8.1 13.76,11.91 U$6.LNA/2
N$16
  Top 0.254: U$1.FEED 13.41,3.89 9.92,7.38 L7.1 10.22,8.44 C6.1
N$17
  Top 0.254: Y4.1 25.06,12.52 28.37,12.55 U$4.9 | Y4.1 23.51,14.21 23.82,14.21 C14.1 | R11.1 22.29,12.84 Y4.1
N$18
  Top 0.254: Y4.3 26.92,12.06 U$4.10 | Y4.3 24.51,11.67 22.5,11.67 R11.2 | Y4.3 25.81,8.45 C15.1
N$19
  Top 0.254: C10.1 C9.1 | C9.1 29.18,10.17 U$4.11 | C9.1 29.18,9.81 | L2.2 29.34,9.66 C9.1
N$20
  Top 0.254: L6.1 L5.1 32.5,10.25 32.11,10.64 30.45,10.64 30.18,10.92 U$4.13
N$21
  Top 0.254: U$4.19 32.35,13.56 32.61,13.82 32.61,14.87 33.57,15.82 C8.2
N$23
  Top 0.254: L2.1 31.69,9.42 L5.2 30.58,9.83 29.68,10.74 U$4.12
N$24
  Top 0.254: U$4.16 31.98,11.92 32.59,11.3 33.47,11.3 R12.1
N$25
  Top 0.254: L6.2 36.1,9.93 C13.1
N$26
  Top 0.254: C12.1 38.08,8.12 C13.2 36.22,6.1 38.51,3.81 U$2.FEED
N$27
  Top 0.254: U1.32 25.97,44.17 C29.2 23.79,44.44 Y2.3
N$28
  Top 0.254: U1.33 21.33,39.28 C30.2 19.95,42.28 Y2.1
N$29
  Top 0.254: LED4.A R17.2
N$30
  Top 0.254: 13.18,52.83 13.18,52.86 13.23,52.86
N$32
  Top 0.254: U$6.MTCK/12 18.17,17.68 R5.2
N$34  (via drill 0.6)
  Top 0.178: U3.10 12.5,38.51 13.01,39.01 v13.01,39.24
  Top 0.254: C27.2 12.68,42.14 v11.71,41.17
  Bottom 0.178: v11.71,41.17 11.71,40.54 v13.01,39.24
N$35  (via drill 0.6)
  Top 0.178: U$3.6 12.9,24.59 14.15,25.83 v14.15,26.36
  Top 0.254: v16.18,26.95 17.97,26.95 R18.1
  Bottom 0.178: v14.15,26.36 14.15,26.44 14.61,26.9
  Bottom 0.254: v16.18,26.95 14.73,26.95 v14.15,26.36
N$36
  Top 0.178: 13.18,53.59 13.18,53.67
N$37
  Top 0.178: 13.18,52.22 13.18,52.2
N$38
  Top 0.254: U$6.RES12K/31 12.26,16.68 11.89,16.31 10.9,16.31 5.93,11.35 R1.1
N$39  (via drill 0.6)
  Top 0.254: R26.2 45.53,48.26 44.86,48.26 42.82,46.23 42.82,40.77 44.6,38.99 44.6,33.66 v47.27,30.99 | v51.71,30.73 54.82,30.73 U$8.R
  Bottom 0.254: v47.27,30.99 51.46,30.99 v51.71,30.73
N$40
  Top 0.254: U$20.24 49.52,50.01 51.46,51.94 53.2,51.94 R19.1
N$41
  Top 0.254: U$8.B 55.59,31.62 50.06,31.62 45.62,36.07 45.62,39.5 43.84,41.27 43.84,44.73 45.14,46.02 45.7,46.02 R27.2 45.59,46.08
N$42
  Top 0.254: U$8.G 50.19,29.72 45.11,34.8 45.11,39.24 43.33,41.02 43.33,45.44 45.11,47.22 45.65,47.22 R25.2
N$45
  Top 0.254: U$11.B 55.59,34.19 51.61,34.19 47.14,38.66 47.14,40.26 45.74,41.66 45.74,42.43 R28.2 45.76,42.26
N$46  (via drill 0.6)
  Top 0.254: 45.57,44.88 R29.2 45.16,44.88 44.35,44.07 44.35,41.53 46.13,39.75 46.13,37.01 v49.86,33.27 | v52.78,33.3 54.87,33.3 U$11.R
  Bottom 0.254: v49.86,33.27 52.76,33.27 v52.78,33.3
N$47
  Top 0.254: R30.2 45.24,43.66 44.86,43.28 44.86,41.78 46.63,40.01 46.63,38.02 52.4,32.26 U$11.G
N$48
  Top 0.254: U$20.3 48.11,45.74 47.78,46.08 R27.1
N$49
  Top 0.254: U$20.1 48.61,46.74 48.49,46.86 48.49,48.01 48.03,48.46 R26.1
N$50
  Top 0.254: R31.2 51.84,38.68 53.8,36.73 56.06,36.73 56.36,36.43 U$13.B
N$51
  Top 0.254: U$20.6 48.66,44.24 48.54,44.12 48.54,43.54 47.45,42.44 R28.1
N$60  (via drill 0.6)
  Top 0.254: U$13.R 53.42,35.96 v50.98,38.41 | v48.69,38.76 48.69,40.52 R32.2
  Bottom 0.254: v50.98,38.41 49.05,38.41 v48.69,38.76
N$61
  Top 0.254: R33.2 49.86,37.67 52.73,34.8 U$13.G
N$62
  Top 0.254: R34.2 56.36,43.23 U$14.B
N$63
  Top 0.254: 55,38.56 U$14.R 53.82,39.67 53.39,39.67 53.01,40.06 R35.2
N$73
  Top 0.254: U$20.2 48.45,46.24 48.03,46.66 48.03,47.02 47.75,47.3 R25.1
N$75
  Top 0.254: U$20.4 47.41,45.24 R29.1
N$76
  Top 0.254: U$20.5 48.35,44.74 47.27,43.66 R30.1
N$78
  Top 0.254: U$20.7 49.52,43.43 48.67,42.57 R32.1
N$79
  Top 0.254: U$20.8 50.02,42.01 R33.1
N$80
  Top 0.254: U$20.10 51.02,42.67 R31.1 51.74,41.95
N$81  (via drill 0.6)
  Top 0.254: U$14.G 54.38,37.34 53.67,38.05 v53.67,38.35 | R36.2 55.06,40.55 v55.47,40.13
  Bottom 0.254: v53.67,38.35 54.56,39.24 55.22,39.24 55.47,39.5 v55.47,40.13
N$82
  Top 0.254: U$20.11 51.52,43.06 51.97,42.62 52.58,42.62 53.01,42.19 R35.1 52.93,41.92
N$83
  Top 0.254: U$20.12 52.02,43.43 52.27,43.18 53.7,43.18 54.18,42.7 R36.1
N$84
  Top 0.254: U$20.13 54.04,44.24 R34.1
N$85  (via drill 0.6)
  Top 0.254: U$20.14 54.8,44.74 56.41,46.35 v56.41,46.86
  Bottom 0.254: v56.41,46.86 57.56,48.01 57.56,49.02 59.46,50.93 JP3.4
N$86
  Top 0.254: U$15.B 55.74,21.34 53.87,21.34 53.49,20.95 53.49,17.4 51.41,15.32 R37.2
N$87
  Top 0.254: U$20.23 50.02,49.74 51.71,51.44 55.21,51.44 R20.1 56.57,52.73
N$88
  Top 0.254: U$20.22 50.52,49.48 51.97,50.93 57.19,50.93 R21.1
N$89  (via drill 0.6)
  Top 0.254: U$15.R 54.53,20.72 54.13,20.32 v54.13,16.76 | R38.2 50.99,12.7 53.75,12.7 54.13,13.08 v54.13,13.84
  Bottom 0.254: v54.13,13.84 v54.13,16.76
N$91  (via drill 0.5)
  Top 0.254: v54.51,46.74 53.51,45.74 U$20.16
  Bottom 0.254: v54.51,46.74 55.02,47.24 55.02,58.78 JP3.2
N$92
  Top 0.254: U$21.1 47.66,14.52 49.25,12.93 R38.1
N$93
  Top 0.254: U$21.2 48.1,15.02 49,14.12 R39.1
N$94
  Top 0.254: U$21.3 49.26,15.52 R37.1
N$95
  Top 0.254: U$21.4 47.98,16.02 48.44,16.48 R41.1
N$96
  Top 0.254: U$21.5 47.82,16.52 48.95,17.65 R42.1
N$97
  Top 0.254: R40.1 48.67,18.8 47.7,17.83 47.7,17.25 47.48,17.02 U$21.6
N$98
  Top 0.254: U$21.7 46.77,17.86 47.75,18.85 R44.1
N$99
  Top 0.254: U$21.8 46.27,19.28 R45.1
N$100
  Top 0.254: R39.2 50.79,14.1 52.98,14.1 55.02,16.13 55.02,19.54 U$15.G 55.14,19.42
N$101
  Top 0.254: U$21.10 45.27,19.06 R43.1
N$102
  Top 0.254: U$21.11 44.77,18.2 44.17,18.8 43.64,18.8 43.43,19 R47.1
N$103
  Top 0.254: U$21.12 44.27,17.94 43.94,18.26 42.62,18.26 42.24,18.64 R48.1
N$104
  Top 0.254: U$21.13 R46.1
N$105  (via drill 0.5)
  Top 0.254: U$20.17 53,46.24 53.49,46.74 53.49,47.12 v55.91,49.53 | v55.91,57.02 54.23,57.02 JP3.1
  Bottom 0.254: v55.91,57.02 56.29,56.64 56.29,49.91 v55.91,49.53
N$106
  Top 0.254: U$21.24 46.77,13.66 48.28,12.14 50.58,12.14 R24.1
N$107
  Top 0.254: U$21.23 46.27,13.5 48.11,11.66 49.12,11.66 49.91,10.87 R23.1
N$108
  Top 0.254: U$21.22 45.77,13.19 47.88,11.07 R22.1
N$109
  Top 0.254: U$16.B 55.62,24 53.24,24 50.76,21.53 R40.2
N$112
  Top 0.254: U$16.R 53.39,23.26 52.86,22.73 52.86,17.65 51.69,16.48 R41.2
N$113  (via drill 0.6)
  Top 0.254: R42.2 51.59,17.65 51.97,18.03 v51.97,20.07 | U$16.G 54.74,22.35 v53.87,22.35
  Bottom 0.254: v51.97,20.07 51.97,20.45 v53.87,22.35
N$114
  Top 0.254: R43.2 50.05,26.42 55.65,26.42 56.27,25.8 U$17.B
N$115
  Top 0.254: U$17.R 52.12,25.8 47.75,21.44 R44.2
N$116  (via drill 0.6)
  Top 0.254: R45.2 46.63,20.95 46.63,21.72 47.7,22.78 v47.78,22.78 | U$17.G 52.48,24.64 v51.97,24.13
  Bottom 0.254: v47.78,22.78 50.62,22.78 v51.97,24.13
N$117
  Top 0.254: R46.2 40.85,22.03 47.78,28.96 55.74,28.96 U$18.B
N$118
  Top 0.254: U$18.R 50.41,28.34 43.43,21.36 R47.2
N$119  (via drill 0.6)
  Top 0.254: U$18.G 51.58,27.18 v51.33,27.43 | v48.28,27.56 42.24,21.51 R48.2
  Bottom 0.254: v51.33,27.43 50.95,27.81 48.54,27.81 v48.28,27.56
PS
  Top 0.254: U2.8 14.4,55.24 13.79,55.85 13.79,58.65
  Top 0.406: 13.79,58.65 14.05,58.9 16.33,58.9
  Top 0.61: 16.33,58.9 20.3,58.9 21.93,57.27 R2.2
PTA0  (via drill 0.6)
  Top 0.254: R50.2 37.84,51.44 v40.28,51.44 43.33,51.44 44.2,52.3 U$7.4 | U1.22 30.97,39.41 v31.14,39.24
  Bottom 0.254: v40.28,51.44 40.28,47.88 31.65,39.24 v31.14,39.24
PTA1  (via drill 0.6)
  Top 0.254: U1.23 30.47,39.84 29.36,38.73 29.36,38.23 29.62,37.97 v30.38,37.97 | U$7.8 40.69,53.06 R52.2
  Bottom 0.254: U$7.8 41.66,48.49 31.14,37.97 v30.38,37.97
PTA2  (via drill 0.6)
  Top 0.254: U1.24 29.97,40.1 28.85,38.99 28.85,36.96 29.11,36.7 v29.87,36.7
  Bottom 0.254: U$7.6 42.93,49 30.63,36.7 v29.87,36.7
PTA3  (via drill 0.6)
  Top 0.254: U1.25 29.47,40.37 28.35,39.24 28.35,35.94 29.11,35.18 v29.36,35.18 | R49.2 U$7.2
  Bottom 0.254: U$7.2 45.47,50.77 29.87,35.18 v29.36,35.18
PTB0
  Top 0.178: 11.7,38.11 U3.12 11.7,40 12.32,40.62 13.77,40.62 16.1,38.28 U1.35
PTB1
  Top 0.178: U1.36 16.01,37.78 13.64,40.16 12.62,40.16 12.1,39.63 U3.11
PTB16  (via drill 0.6)
  Top 0.254: v8.03,25.91 11.58,29.46 17.68,29.46 17.93,29.72 17.93,34.67 19.55,36.28 U1.39 | U$6.U0TXD/26 9.67,19.18 v9.3,19.56
  Bottom 0.254: v9.3,19.56 8.03,20.83 v8.03,25.91
PTB17  (via drill 0.6)
  Top 0.254: U1.40 19.81,35.78 18.44,34.42 18.44,29.08 17.93,28.57 v17.42,28.57 | v13.87,28.57 12.19,28.57 8.53,24.92 8.53,21.59 10.44,19.68 U$6.U0RXD/25
  Bottom 0.254: v13.87,28.57 v17.42,28.57
PTB18
  Top 0.254: U1.41 20.07,35.28 18.95,34.16 18.95,28.96 22.66,25.25 22.66,20.75 22.15,20.24 18.67,20.24 17.61,19.18 U$6.GPIO0/15 17.53,19.18
PTB19
  Top 0.254: U1.42 20.33,34.78 19.46,33.91 19.46,29.34 23.16,25.63 23.16,20.5 22.4,19.74 18.85,19.74 17.79,18.68 U$6.GPIO2/14
PTC0  (via drill 0.6)
  Top 0.254: U$6.EXT_RSTB/32 12.47,16.18 11.76,15.47 v11.76,14.83 11.33,14.4 10.74,14.4 R15.1 | U1.43 20.59,34.28 19.96,33.66 19.96,30.61 v23.27,27.3
  Bottom 0.254: v23.27,27.3 23.65,26.92 23.65,20.19 22.68,19.23 20.62,19.23 15.54,14.15 12.45,14.15 v11.76,14.83
PTC1  (via drill 0.6)
  Top 0.254: v23.67,28.68 22.5,29.84 21.49,29.84 20.47,30.86 20.47,33.4 20.86,33.78 U1.44 | U$6.CHIP_EN/7 16.26,13.63 v16.59,13.31
  Bottom 0.254: v23.67,28.68 24.16,28.19 24.16,19.94 22.89,18.67 21.11,18.67 17.42,14.99 17.42,13.72 17.02,13.31 v16.59,13.31
PTC3  (via drill 0.6)
  Top 0.254: U$6.XPD_DCDC/8 16.76,14.89 v18.44,13.84 | v24.28,18.8 24.28,26.92 25.3,27.94 25.3,30.99 25.55,31.24 v26.82,31.24 | U1.46 25.32,32.78 26.06,33.53 26.06,33.78 26.31,34.04 v26.82,34.04
  Bottom 0.254: v26.82,34.04 27.08,33.78 27.08,31.5 v26.82,31.24 | v24.28,18.8 23.65,18.16 21.61,18.16 19.46,16 19.46,14.1 19.2,13.84 v18.44,13.84
PTC4  (via drill 0.6)
  Top 0.254: v25.55,26.54 25.55,27.05 25.97,27.47 U1.49 | U$4.2 30.68,20.28 v29.62,21.34
  Bottom 0.254: v25.55,26.54 26.06,26.04 27.71,26.04 29.23,24.51 29.23,21.72 v29.62,21.34
PTC5  (via drill 0.6)
  Top 0.254: v27.46,21.59 26.47,22.58 U1.50 | U$4.3 30.18,18.87 v28.73,20.32
  Bottom 0.254: v28.73,20.32 v27.46,21.59
PTC6  (via drill 0.6)
  Top 0.254: U1.51 26.97,24.87 27.33,24.51 v27.33,24 | U$4.4 29.68,17.59 v27.84,19.43
  Bottom 0.254: v27.33,24 27.33,22.86 26.44,21.97 26.44,20.83 v27.84,19.43
PTC7
  Top 0.254: 27.48,29.82 U1.52 27.47,25.64 28.47,24.64 28.47,21.34 26.95,19.81 26.95,18.92 29.18,16.7 U$4.5
PTC8  (via drill 0.6)
  Top 0.254: U1.53 27.97,26.67 30.25,24.38 v30.25,23.11 | 27.33,16.51 v27.33,17.14 27.33,14.99 28.26,14.06 U$4.6
  Bottom 0.254: v30.25,23.11 30.63,22.73 30.63,20.95 27.33,17.65 v27.33,17.14
PTC9
  Top 0.254: U1.54 28.47,26.93 31.18,24.22 U$4.1
PTC10  (via drill 0.6)
  Top 0.254: U1.55 28.97,27.19 31.52,24.64 35.81,24.64 v38.48,21.97
  Bottom 0.254: JP1.12 57.94,18.67 45.87,18.67 42.57,21.97 v38.48,21.97
PTC11  (via drill 0.6)
  Top 0.254: U1.56 29.47,27.45 31.77,25.15 37.16,25.15 v39.47,22.84
  Bottom 0.254: JP1.11 58.17,22.68 55.68,25.17 47.9,25.17 45.57,22.84 v39.47,22.84
PTD0  (via drill 0.6)
  Top 0.254: U1.57 29.97,27.71 32.03,25.65 38.76,25.65 v40.69,23.72
  Bottom 0.254: JP1.10 58.83,25.81 47.35,25.81 45.26,23.72 v40.69,23.72
PTD1  (via drill 0.6)
  Top 0.254: U1.58 30.47,27.98 32.28,26.16 40.23,26.16 v41.6,24.79
  Bottom 0.254: JP1.9 58.12,26.47 46.97,26.47 45.29,24.79 v41.6,24.79
PTD2  (via drill 0.6)
  Top 0.254: U1.59 30.97,28.24 32.54,26.67 41.78,26.67 v42.52,25.93
  Bottom 0.254: JP1.8 57.99,28.88 48.03,28.88 45.09,25.93 v42.52,25.93
PTD3  (via drill 0.6)
  Top 0.254: U1.60 31.47,28.5 32.79,27.18 43.33,27.18 v43.48,27.03
  Bottom 0.254: 53.01,29.69 53.03,29.72 | 53.03,29.72 56.16,32.84 JP1.7 | 53.03,29.72 47.85,29.72 45.16,27.03 v43.48,27.03
PTD4  (via drill 0.6)
  Top 0.254: U1.61 31.97,28.76 33.05,27.69 41.55,27.69 41.94,28.07 v44.53,28.07
  Bottom 0.254: JP1.6 58.67,34.65 47.93,34.65 46.25,32.97 46.25,29.06 45.26,28.07 v44.53,28.07
PTD5  (via drill 0.6)
  Top 0.254: U1.62 32.47,28.95 33.22,28.19 41.17,28.19 42.32,29.34 v45.29,29.34
  Bottom 0.254: JP1.5 58.98,37.49 48.18,37.49 45.64,34.95 45.64,29.69 v45.29,29.34
PTD6
  Top 0.254: U1.63 32.97,29.13 33.3,28.8 34.38,28.8 R8.1
PTD7  (via drill 0.6)
  Top 0.254: v30.89,31.24 32.92,31.24 33.47,30.69 U1.64 | R17.1 8.31,31.5 v9.02,32.21
  Bottom 0.254: v30.89,31.24 29.87,30.23 26.31,30.23 24.03,32.51 9.32,32.51 v9.02,32.21
RESET_B  (via drill 0.6)
  Top 0.254: U1.34 25.35,38.78 v25.81,39.24 | R53.2 37.78,54.03 U$7.10 | v27.84,50.8 v27.84,48.13
  Bottom 0.254: v25.81,39.24 26.82,39.24 27.84,40.26 v27.84,48.13 | U$7.10 38.43,52.07 28.6,52.07 27.84,51.31 v27.84,50.8
SCL  (via drill 0.6)
  Top 0.178: U1.37 15.44,37.28 14.58,36.42 13.66,36.42 13.3,36.06 U3.23 13.3,35.19
  Top 0.254: U$20.19 52.02,47.94 52.22,48.13 53.11,48.13 54,49.02 v54,49.53 | U1.37 25.37,37.28 v25.81,37.72 | U$21.19 44.27,13.51 44.09,13.34 41.68,13.34 39.27,15.75 v39.27,16.18 | 37.69,20.41 R14.2 36.41,20.2 v35.36,21.26 v35.36,23.44
  Bottom 0.254: v25.81,37.72 26.06,37.72 26.57,37.21 26.57,36.45 30.25,32.77 31.39,32.77 35.08,29.08 35.08,27.89 | 35.08,27.89 38,30.81 38,33.91 39.78,35.69 39.78,42.55 45.87,48.64 50.95,48.64 52.22,49.91 53.62,49.91 v54,49.53 | 35.08,27.89 35.08,24.38 35.36,24.11 v35.36,23.44 | v35.36,21.26 35.36,20.42 36.22,19.56 38.25,19.56 39.27,18.54 v39.27,16.18
SD-CLK
  Top 0.178: 17.8,22.78 16.97,22.78 16.31,23.44 15.09,23.44 14.71,23.07 14.71,20.23 U$6.SD_CLK/21
  Top 0.254: 17.8,22.78 18.69,22.78 18.97,23.06 18.97,24.25 R18.2
SD-CMD
  Top 0.178: U$3.1 17.21,22.28 16.89,22.28 16.15,23.01 15.47,23.01 15.11,22.66 15.11,21.31 15.26,21.16 U$6.SD_CMD/20
SD-D0
  Top 0.178: U$3.2 16.79,23.9 14.86,23.9 14.26,23.3 U$6.SD_DATA_0/22
SD-D1  (via drill 0.6)
  Top 0.178: v12.22,20.85 13.46,20.85 13.76,20.55 U$6.SD_DATA_1/23 | U$3.5 12.89,26.91 v12.65,27.15
  Bottom 0.178: v12.65,27.15 12.45,27.15 12.22,26.92 12.22,21.59 11.96,21.34 11.96,21.11 v12.22,20.85
SD-D2  (via drill 0.6)
  Top 0.178: U$3.7 13.28,23.4 14.38,24.5 v14.38,24.69 | v18.36,21.77 18.24,21.64 16.71,21.64 16.26,21.19 U$6.SD_DATA_2/18
  Bottom 0.178: v14.38,24.69 14.38,25.02 15.19,25.83 16.66,25.83 18.36,24.13 v18.36,21.77
SD-D3  (via drill 0.6)
  Top 0.178: v15.93,24.82 16.13,25.02 16.87,25.02 U$3.3 | U$6.SD_DATA_3/19 15.76,21.38 15.95,21.57 v15.95,22.05
  Bottom 0.178: 15.9,24.79 v15.93,24.82 15.88,24.77 15.88,22.12 v15.95,22.05
SDA  (via drill 0.6)
  Top 0.178: U1.38 16.64,36.78 v16.26,36.4 | U3.24 13.7,34.33 13.46,34.09 13.46,33.66 v13.72,33.4
  Top 0.254: U$21.20 44.77,13.24 44.35,12.83 40.62,12.83 38.3,15.14 38.3,16.89 38.71,17.3 39.65,17.3 40.18,17.83 40.18,19.38 39.33,20.23 R13.2 | R13.2 38.71,20.31 | U$20.20 51.52,48.32 52.22,49.02 v52.73,49.02 | v36.37,22.45 37.69,21.13 38.73,21.13 39.04,20.83 R13.2 | U1.38 24.96,36.78 v26.06,35.69
  Bottom 0.178: v16.26,36.4 15.54,35.69 15.54,34.34 14.61,33.4 v13.72,33.4
  Bottom 0.254: v26.06,35.69 26.57,35.69 30,32.26 31.14,32.26 34.44,28.96 34.44,23.01 35,22.45 v36.37,22.45 36.37,25.12 35.59,25.91 35.59,27.69 38.51,30.61 38.51,33.66 40.28,35.43 40.28,42.29 45.49,47.5 52.35,47.5 52.98,48.13 52.98,48.77 v52.73,49.02
SOFTPOWER
  Top 0.254: U2.6 15.4,54.92 15.57,55.09 16.08,55.09 16.84,54.33
  Top 0.406: 16.84,54.33 17.39,54.33 R10.1
UVLO
  Top 0.254: 14.9,55.73 R4.2 14.9,55.71 U2.7
  Top 0.406: R3.1 17.08,55.51 17.68,54.91 18.66,54.91 C2.2
  Top 0.61: R3.1 15.41,55.93 R4.2
VAUX  (via drill 0.6)
  Top 0.254: U2.1 13.4,51.02 13.11,50.72
  Top 0.406: 13.11,50.72 12.85,50.72 v12.34,51.23
  Top 0.61: v9.73,49.25 9.68,49.3 C4.1
  Bottom 0.61: v12.34,51.23 12.09,51.23 10.11,49.25 v9.73,49.25
VCC  (via drill 0.6)
  Top 0.254: U2.5 15.4,50.97 15.65,50.72
  Top 0.406: 15.65,50.72 16.28,50.72 | R10.2 18.92,51.14 C2.1 20.84,51.26 21.79,51.26 22.23,51.69 22.23,53.39 21.54,54.08 21.08,54.08 20.23,54.93 R2.1
  Top 0.61: 16.28,50.72 16.85,50.72 | 16.85,50.72 C1.1 17.25,51.12 R10.2 | 16.85,50.72 17.63,49.95 L1.2 | R3.2 R2.1
  Top 0.813: L1.2 17.63,46.69 16.66,45.72 v12.85,45.72 | S1.2 6.84,38.77 7.39,39.32 v7.39,40.36
  Bottom 0.813: v12.85,45.72 8.79,45.72 7.39,44.32 v7.39,40.36
VDDA
  Top 0.254: 37.85,37.66 R16.1 | R16.1 37.67,37.78 U1.13 | C17.1 40.03,37.49 | L3.1 40.84,36.23 40.84,37.13 40.12,37.86 C17.1 | C17.1 37.87,37.86 R16.1
VRAW  (via drill 0.6)
  Top 0.813: S1.1 7.66,37.27 v7.7,37.31
  Bottom 0.813: JP5.2 29.21,53.47 23.77,53.47 14.12,43.81 11.86,43.81 9.91,41.86 9.91,39.4 7.82,37.31 v7.7,37.31
VREF_OUT  (via drill 0.6)
  Top 0.254: C16.1 36.88,35.37 v36.88,35.26 | U1.17 33.47,36.41 v33.68,36.2
  Bottom 0.254: v36.88,35.26 36.88,31.9 36.09,31.11 34.7,31.11 33.55,32.26 v33.68,36.2
VREFH
  Top 0.254: C11.1 37.82,40.78 R16.2 36.77,38.28 U1.14
VREFL  (via drill 0.6)
  Top 0.254: U1.15 U1.16 36.01,39.28 36.47,39.75 36.47,41.15 37.52,42.19 38.85,42.19 C11.2 | C11.2 40.03,41.01 C17.2 41.05,38.49 41.05,37.69 41.77,36.97 L4.2 | v41.22,41.17 39.91,41.17 C11.2 | C16.2 39.64,34.89 v40.54,33.98
  Bottom 0.254: v41.22,41.17 41.4,41 41.4,34.31 41.07,33.98 v40.54,33.98
XTAL_IN
  Top 0.254: C23.1 Y3.3 7.52,18.18 U$6.XTAL_IN/28
XTAL_OUT
  Top 0.254: 4.08,22.38 C7.1 4.51,21.18 Y3.1 6.15,18.68 U$6.XTAL_OUT/27